# Altium project main_board.PrjPCB
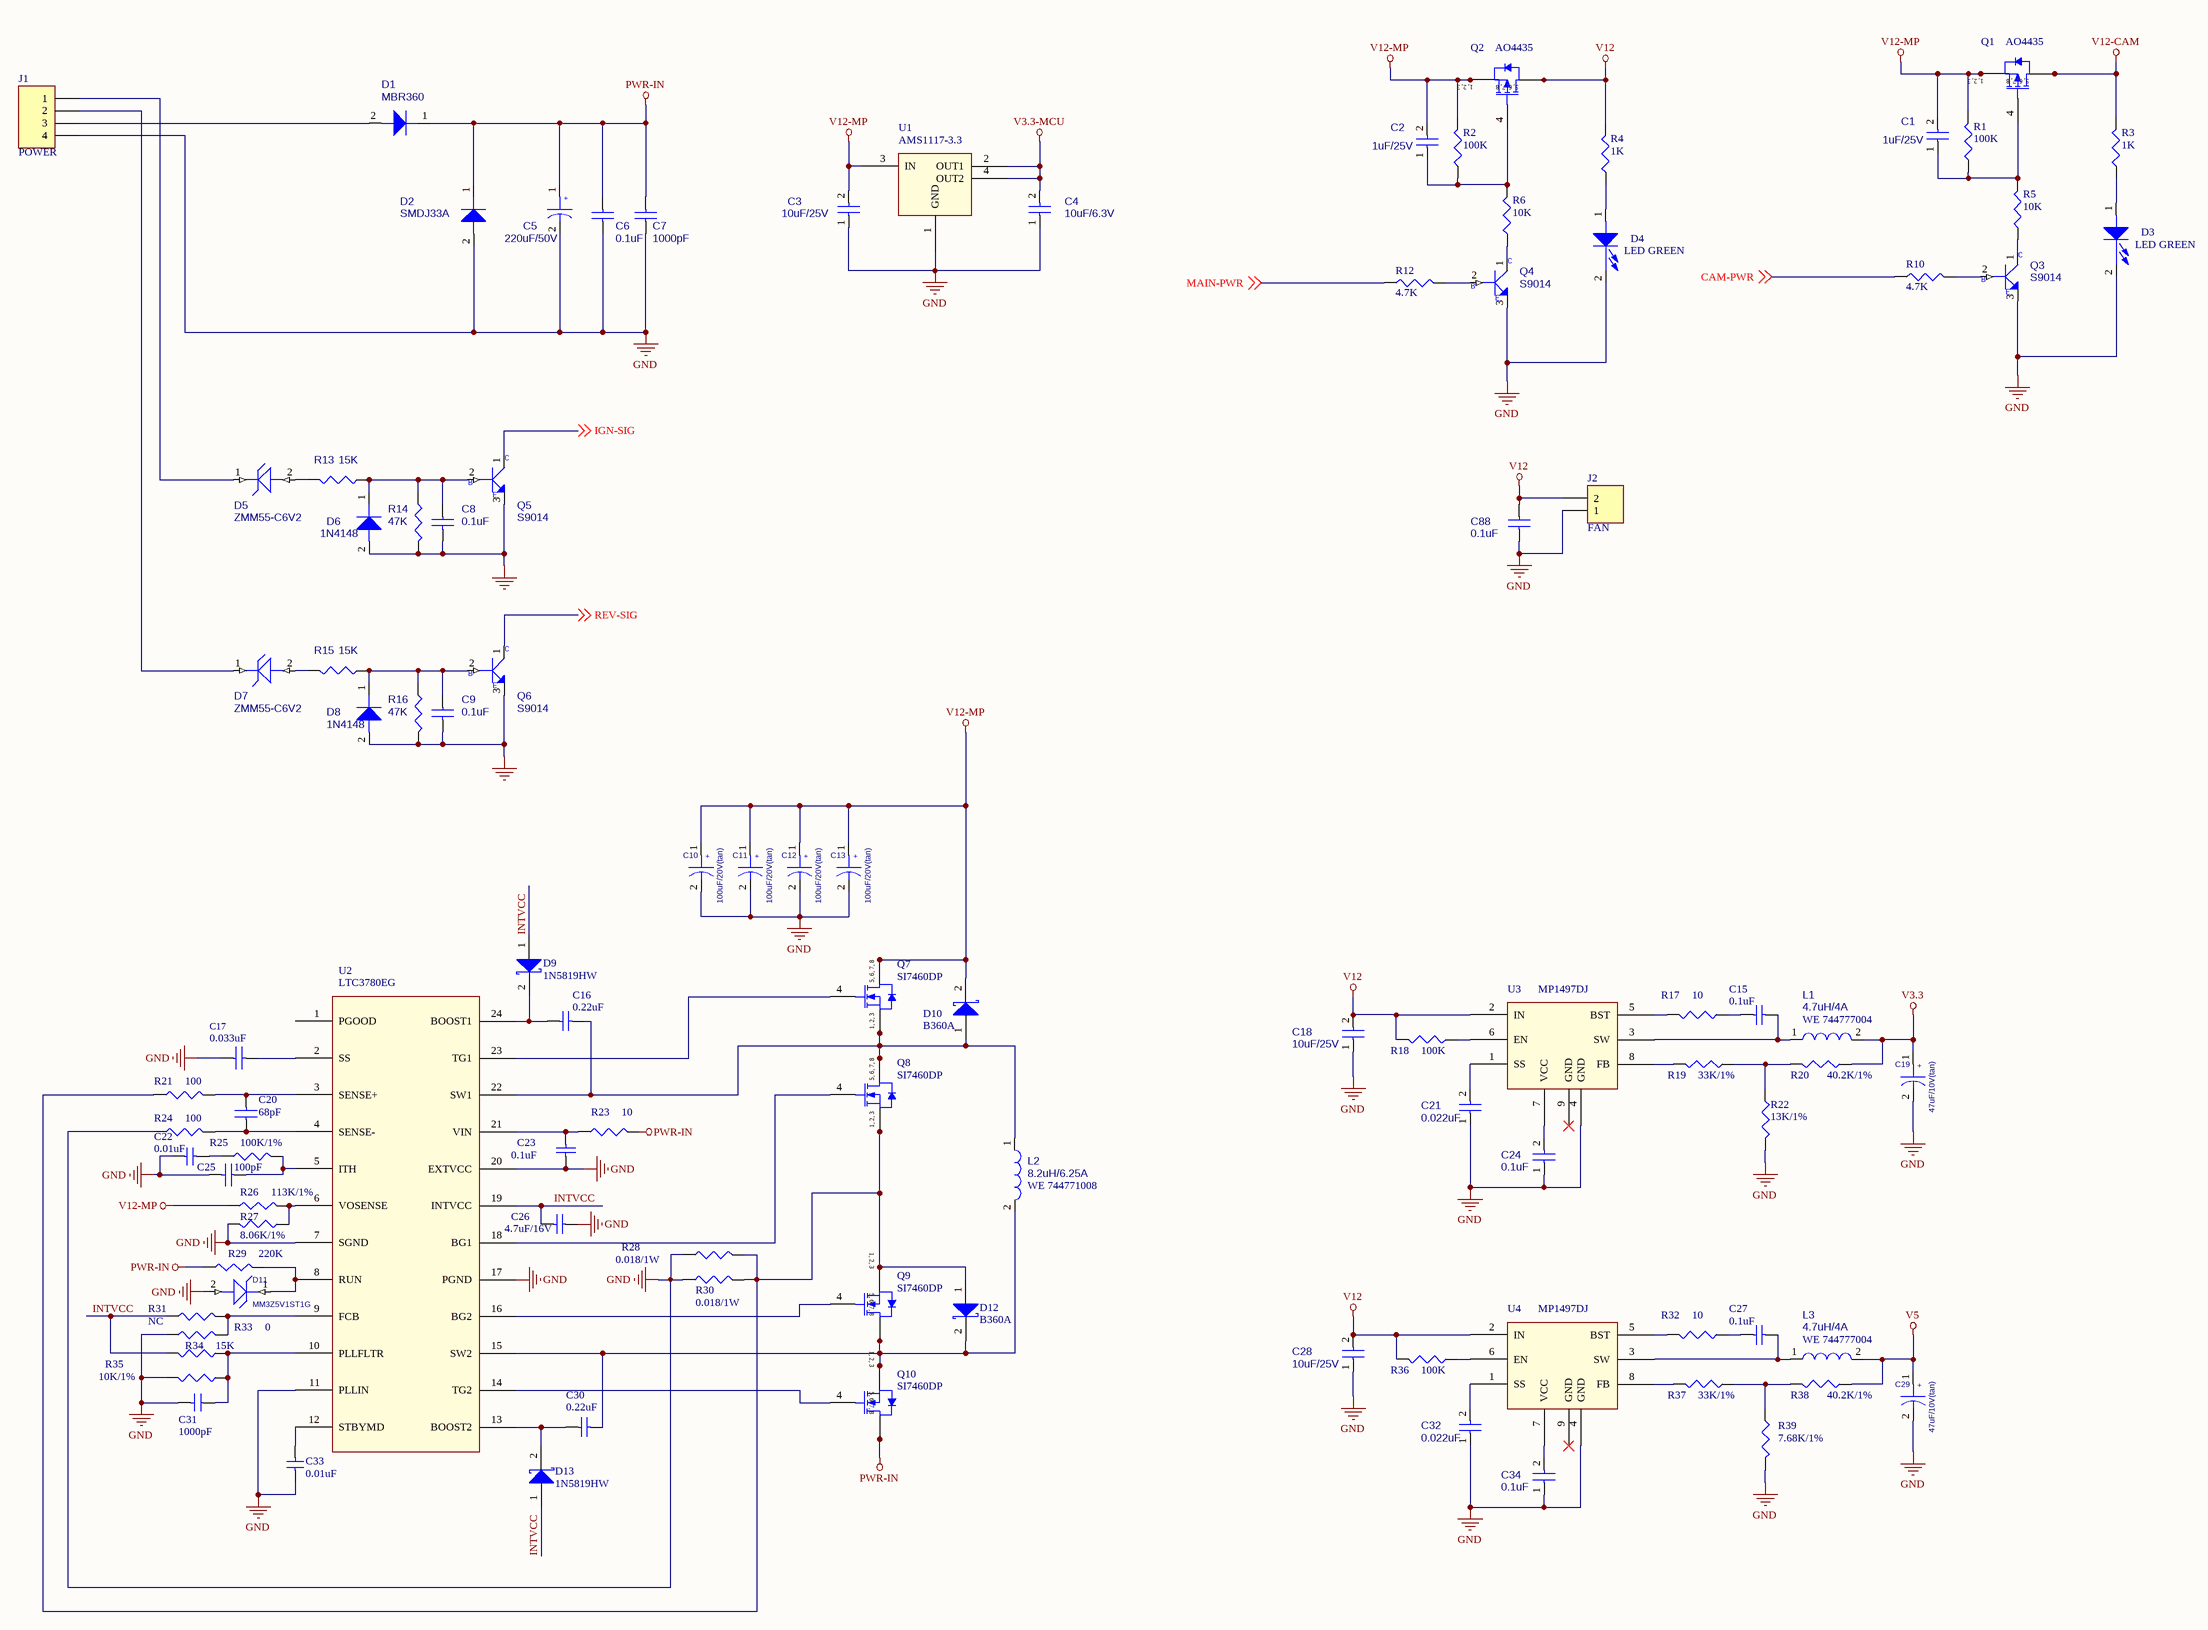
[diagram p0: [01]POWER.SchDoc]
12 sheets, 319 parts. Net scope: global (net labels, ports and power ports of the same name join across sheets).
Board file: main_board.PcbDoc
Sheets:
  [01]POWER.SchDoc
  [02]MCU.SchDoc
  [03]CORE_BOARD.SchDoc
  [04]STORAGE.SchDoc
  [05]USB_HUB.SchDoc
  [06]EXT_UART.SchDoc
  [07]CELLULAR.SchDoc
  [08]GPS.SchDoc
  [09]ADC.SchDoc
  [10]MISC.SchDoc
  [11]SERIAL_PORT.SchDoc
  [12]IO_PORT.SchDoc

## Sheet [01]POWER.SchDoc
size C

### Parts
C1  1uF/25V  [0805]
C2  1uF/25V  [0805]
C3  10uF/25V  [1812]
C4  10uF/6.3V  [0805]
C5  220uF/50V  [DL-10*10.5]
C6  0.1uF  [0603]
C7  1000pF  [0603]
C8  0.1uF  [0603]
C9  0.1uF  [0603]
C10  100uF/20V(tan)  [7343]
C11  100uF/20V(tan)  [7343]
C12  100uF/20V(tan)  [7343]
C13  100uF/20V(tan)  [7343]
C15  0.1uF  [0603]
C16  0.22uF  [0603]
C17  0.033uF  [0603]
C18  10uF/25V  [1812]
C19  47uF/10V(tan)  [3528]
C20  68pF  [0603]
C21  0.022uF  [0603]
C22  0.01uF  [0603]
C23  0.1uF  [0603]
C24  0.1uF  [0603]
C25  100pF  [0603]
C26  4.7uF/16V  [0805]
C27  0.1uF  [0603]
C28  10uF/25V  [1812]
C29  47uF/10V(tan)  [3528]
C30  0.22uF  [0603]
C31  1000pF  [0603]
C32  0.022uF  [0603]
C33  0.01uF  [0603]
C34  0.1uF  [0603]
C88  0.1uF  [0603]
D1  MBR360  [DO214AB]
D2  SMDJ33A  [DO214AB]
D3  LED GREEN  [LED0603]
D4  LED GREEN  [LED0603]
D5  ZMM55-C6V2  [MINI-MELF]
D6  1N4148  [MINI-MELF]
D7  ZMM55-C6V2  [MINI-MELF]
D8  1N4148  [MINI-MELF]
D9  1N5819HW  [1N5819]
D10  B360A  [B320A]
D11  MM3Z5V1ST1G  [MM3Z5V1ST1G]
D12  B360A  [B320A]
D13  1N5819HW  [1N5819]
J1  POWER  [5557-4PIN]
J2  FAN  [XH2.0-2P-SMD]
L1  4.7uH/4A  code: WE 744777004  [IND-4.7UH-4A]
L2  8.2uH/6.25A  code: WE 744771008  [IND-8.2UH-10A]
L3  4.7uH/4A  code: WE 744777004  [IND-4.7UH-4A]
Q1  AO4435  [SO8]
Q2  AO4435  [SO8]
Q3  S9014  [NPN]
Q4  S9014  [NPN]
Q5  S9014  [NPN]
Q6  S9014  [NPN]
Q7  SI7460DP  [POWERPAK]
Q8  SI7460DP  [POWERPAK]
Q9  SI7460DP  [POWERPAK]
Q10  SI7460DP  [POWERPAK]
R1  100K  [0603]
R2  100K  [0603]
R3  1K  [0603]
R4  1K  [0603]
R5  10K  [0603]
R6  10K  [0603]
R10  4.7K  [0603]
R12  4.7K  [0603]
R13  15K  [0603]
R14  47K  [0603]
R15  15K  [0603]
R16  47K  [0603]
R17  10  [0603]
R18  100K  [0603]
R19  33K/1%  [0603]
R20  40.2K/1%  [0603]
R21  100  [0603]
R22  13K/1%  [0603]
R23  10  [0603]
R24  100  [0603]
R25  100K/1%  [0603]
R26  113K/1%  [0603]
R27  8.06K/1%  [0603]
R28  0.018/1W  [2512]
R29  220K  [0603]
R30  0.018/1W  [2512]
R31  NC  [0603]
R32  10  [0603]
R33  0  [0603]
R34  15K  [0603]
R35  10K/1%  [0603]
R36  100K  [0603]
R37  33K/1%  [0603]
R38  40.2K/1%  [0603]
R39  7.68K/1%  [0603]
U1  AMS1117-3.3  [AMS1117]
U2  LTC3780EG  [LTC3780EG]
U3  MP1497DJ  [TSOT23-8]
U4  MP1497DJ  [TSOT23-8]

### Nets
GND: C3.1 C4.1 C5.2 C6.1 C7.1 C8.2 C9.2 C10.2 C11.2 C12.2 C13.2 C17.1 C18.1 C19.2 C21.1 C22.1 C23.1 C24.1 C25.2 C26.2 C28.1 C29.2 C31.2 C32.1 C33.1 C34.1 C88.1 D2.2 D3.2(CATHODE) D4.2(CATHODE) D6.2 D8.2 D11.2 J1.4 J2.1 Q3.3(EMITTER) Q4.3(EMITTER) Q5.3(EMITTER) Q6.3(EMITTER) R14.2 R16.2 R22.2 R24.1 R27.2 R28.1 R30.1 R33.1 R35.2 R39.2 U1.1(GND) U2.7(SGND) U2.11(PLLIN) U2.17(PGND) U2.20(EXTVCC) U3.4(GND) U4.4(GND)
PWR-IN: C5.1 C6.2 C7.2 D1.1 D2.1 Q10.5(D) Q10.6(D) Q10.7(D) Q10.8(D) R23.2 R29.1
V3.3: C19.1 L1.2 R20.1
V3.3-MCU: C4.2 U1.2(OUT1) U1.4(OUT2)
V5: C29.1 L3.2 R38.1
V12: C18.2 C28.2 C88.2 J2.2 Q2.5(D) Q2.6(D) Q2.7(D) Q2.8(D) R4.2 R18.2 R36.2 U3.2(IN) U4.2(IN)
V12-CAM: Q1.5(D) Q1.6(D) Q1.7(D) Q1.8(D) R3.2
V12-MP: C1.2 C2.2 C3.2 C10.1 C11.1 C12.1 C13.1 D10.2(K) Q1.1(S) Q1.2(S) Q1.3(S) Q2.1(S) Q2.2(S) Q2.3(S) Q7.5(D) Q7.6(D) Q7.7(D) Q7.8(D) R1.2 R2.2 R26.1 U1.3(IN)
CAM-PWR: R10.1 ; off-sheet CAM-PWR
IGN-SIG: Q5.1(COLLECTOR) ; off-sheet IGN-SIG
INTVCC: C26.1 D9.1(A) D13.1(A) R31.1 R34.2 U2.19(INTVCC)
MAIN-PWR: R12.1 ; off-sheet MAIN-PWR
REV-SIG: Q6.1(COLLECTOR) ; off-sheet REV-SIG
NetC1_1: C1.1 Q1.4(G) R1.1 R5.2
NetC2_1: C2.1 Q2.4(G) R2.1 R6.2
NetC8_1: C8.1 D6.1 Q5.2(BASE) R13.1 R14.1
NetC9_1: C9.1 D8.1 Q6.2(BASE) R15.1 R16.1
NetC15_1: C15.1 L1.1 U3.3(SW)
NetC15_2: C15.2 R17.1
NetC16_1: C16.1 D10.1(A) L2.1 Q7.1(S) Q7.2(S) Q7.3(S) Q8.5(D) Q8.6(D) Q8.7(D) Q8.8(D) U2.22(SW1)
NetC16_2: C16.2 D9.2(K) U2.24(BOOST1)
NetC17_2: C17.2 U2.2(SS)
NetC20_1: C20.1 R24.2 U2.4(SENSE-)
NetC20_2: C20.2 R21.2 U2.3(SENSE+)
NetC21_2: C21.2 U3.1(SS)
NetC22_2: C22.2 R25.1
NetC23_2: C23.2 R23.1 U2.21(VIN)
NetC24_2: C24.2 U3.7(VCC)
NetC25_1: C25.1 R25.2 U2.5(ITH)
NetC27_1: C27.1 L3.1 U4.3(SW)
NetC27_2: C27.2 R32.1
NetC30_1: C30.1 D12.2(K) L2.2 Q9.5(D) Q9.6(D) Q9.7(D) Q9.8(D) Q10.1(S) Q10.2(S) Q10.3(S) U2.15(SW2)
NetC30_2: C30.2 D13.2(K) U2.13(BOOST2)
NetC31_1: C31.1 R34.1 R35.1 U2.10(PLLFLTR)
NetC32_2: C32.2 U4.1(SS)
NetC33_2: C33.2 U2.12(STBYMD)
NetC34_2: C34.2 U4.7(VCC)
NetD1_2: D1.2 J1.3
NetD3_1: D3.1(ANODE) R3.1
NetD4_1: D4.1(ANODE) R4.1
NetD5_1: D5.1 J1.1
NetD5_2: D5.2 R13.2
NetD7_1: D7.1 J1.2
NetD7_2: D7.2 R15.2
NetD11_1: D11.1 R29.2 U2.8(RUN)
NetD12_1: D12.1(A) Q8.1(S) Q8.2(S) Q8.3(S) Q9.1(S) Q9.2(S) Q9.3(S) R21.1 R28.2 R30.2
NetQ3_1: Q3.1(COLLECTOR) R5.1
NetQ3_2: Q3.2(BASE) R10.2
NetQ4_1: Q4.1(COLLECTOR) R6.1
NetQ4_2: Q4.2(BASE) R12.2
NetQ7_4: Q7.4(G) U2.23(TG1)
NetQ8_4: Q8.4(G) U2.18(BG1)
NetQ9_4: Q9.4(G) U2.16(BG2)
NetQ10_4: Q10.4(G) U2.14(TG2)
NetR17_2: R17.2 U3.5(BST)
NetR18_1: R18.1 U3.6(EN)
NetR19_1: R19.1 R20.2 R22.1
NetR19_2: R19.2 U3.8(FB)
NetR26_2: R26.2 R27.1 U2.6(VOSENSE)
NetR31_2: R31.2 R33.2 U2.9(FCB)
NetR32_2: R32.2 U4.5(BST)
NetR36_1: R36.1 U4.6(EN)
NetR37_1: R37.1 R38.2 R39.1
NetR37_2: R37.2 U4.8(FB)

Not connected (* = marked no-connect by the designer): U2 1(PGOOD); U3 9(GND)*; U4 9(GND)*

### Notes on the sheet
- (in symbol CAP WP) +
- (in symbol MMBT3904_NL_SOT23-3) C; B; E
- (in symbol SI4410DY) 1, 2, 3; 5, 6, 7, 8
- (in symbol SI4431DY) 1, 2, 3; 5, 6, 7, 8

### Library data of the parts
C1-C4 C6 C7 C18 C21 C24 C28 C32 C34 C88 = CAP NP_Dup2
C5 C10-C13 C19 C29 = CAP WP
C8 C9 = CAP
C15 C16 C23 C26 C27 C30 = Cap: Capacitor
C17 C20 = 06033C223KAT1A_0
C22 = 06033C103KAT2A
C25 = 06035A470KAT1A_0
C31 C33 = 06033C103KAT2A_0
D1 D2 D6 D8 = 1N4148WS-7-F_SOD323-2
D3 D4 = LN01401_1
D5 D7 D11 = MMGZ5231BPTLL34
D9 D10 D12 D13 = Diode 11DQ03: Schottky Rectifier
J1 = Header 4: Header, 4-Pin
J2 = Header 2: Header, 2-Pin; LatestRevisionDate: 17-Jul-2002; LatestRevisionNote: Re-released for DXP Platform.; Publisher: Altium Limited
L1-L3 = 4.7UH_CDH2D09BNP-4R7MC_0.7A_20%
Q1 Q2 = SI4431DY: P-Channel 30V (D-S)  MOSFET; Published: 8-Jun-2000; LatestRevisionDate: 13-Apr-2006; LatestRevisionNote: IPC-7351 Footprint Added.; DatasheetVersion: 6-Oct-1997; PackageVersion: Aug-1998; PackageReference: SO-8; Publisher: Altium Limited; PackageDescription: 8-Pin Small Outline Integrated Circuit 1.27 mm Pitch; ComponentLink1Description: Manufacturer Link; ComponentLink1URL: http://www.vishay.com/; ComponentLink2Description: Datasheet; ComponentLink2URL: http://www.vishay.com/docs/70151/70151.pdf
Q3-Q5 = MMBT3904_NL_SOT23-3: Part Description: S TR MMBT3904_NL NPN SOT23; Part Number: SB039040000
Q6 = MMBT3904_NL_SOT23-3
Q7-Q10 = SI4410DY: N-Channel 30V (D-S)  MOSFET
R1-R6 R10 R12 R17-R20 R22 R23 R25 R28 R30-R39 = CR16-1003FM
R13-R16 = R
R21 R24 = CR16-1241FM
R26 = CR16-1133FM
R27 = CR16-8061FM
R29 = CR16-224JM
U1 = LT1963EST-1_4.8
U3 U4 = MP1482_5

## Sheet [02]MCU.SchDoc
size B
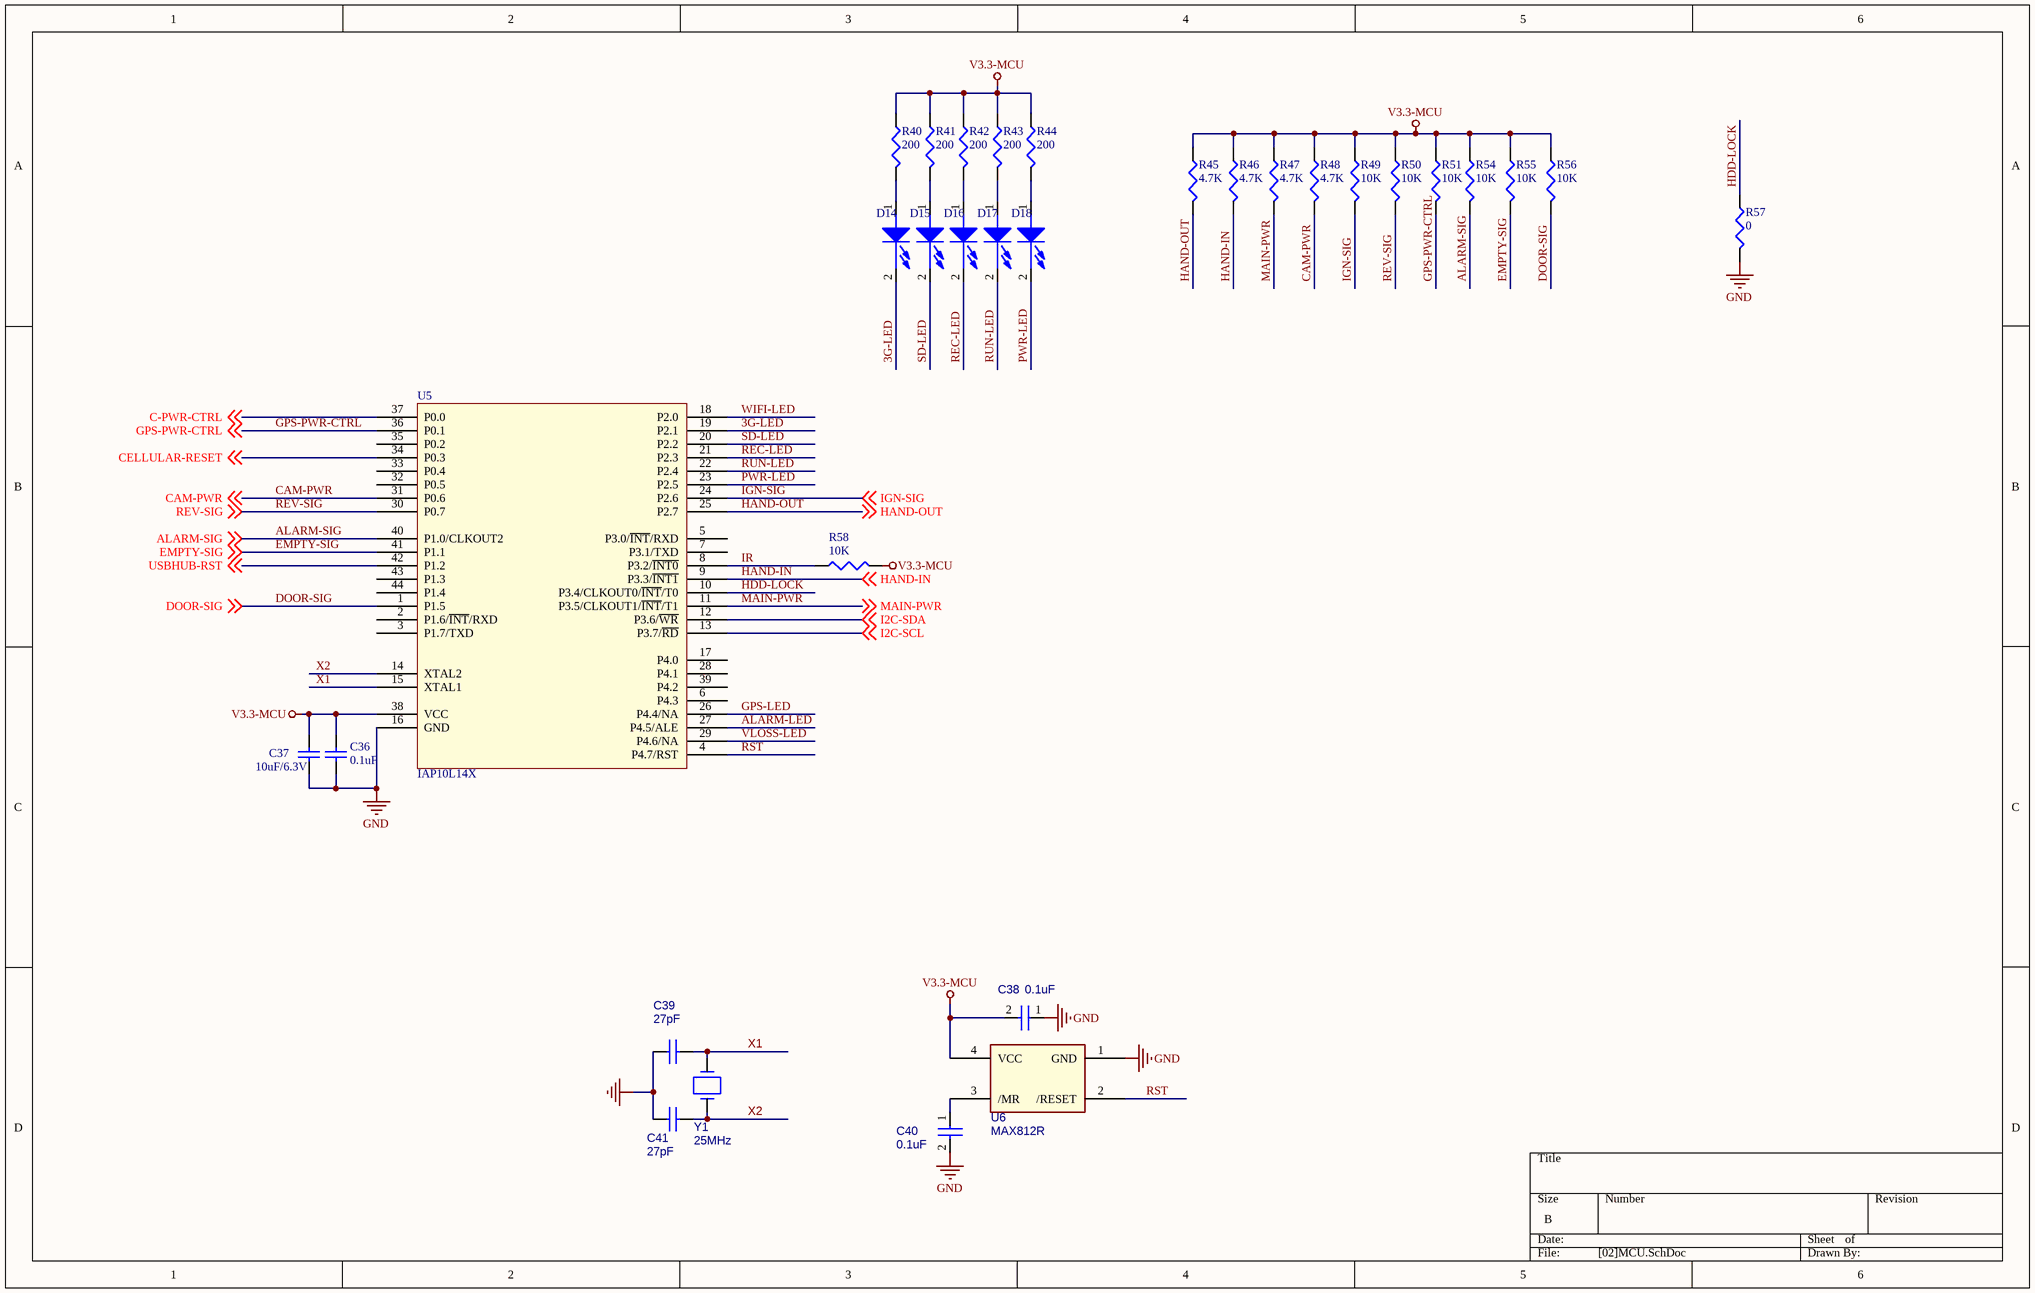
[diagram p1: [02]MCU.SchDoc]

### Parts
C36  0.1uF  [0603]
C37  10uF/6.3V  [0805]
C38  0.1uF  [0603]
C39  27pF  [0603]
C40  0.1uF  [0603]
C41  27pF  [0603]
D14  LED GREEN  [LED0603]  (value not drawn)
D15  LED GREEN  [LED0603]  (value not drawn)
D16  LED GREEN  [LED0603]  (value not drawn)
D17  LED GREEN  [LED0603]  (value not drawn)
D18  LED GREEN  [LED0603]  (value not drawn)
R40  200  [0603]
R41  200  [0603]
R42  200  [0603]
R43  200  [0603]
R44  200  [0603]
R45  4.7K  [0603]
R46  4.7K  [0603]
R47  4.7K  [0603]
R48  4.7K  [0603]
R49  10K  [0603]
R50  10K  [0603]
R51  10K  [0603]
R54  10K  [0603]
R55  10K  [0603]
R56  10K  [0603]
R57  0  [0603]
R58  10K  [0603]
U5  IAP10L14X  [LQFP44]
U6  MAX812R  [SOT143]
Y1  25MHz  [SMD-XTAL-5032]

### Nets
GND: C36.1 C37.1 C38.1 C39.1 C40.2 C41.1 R57.2 U5.16(GND) U6.1(GND)
V3.3-MCU: C36.2 C37.2 C38.2 R40.1 R41.1 R42.1 R43.1 R44.1 R45.1 R46.1 R47.1 R48.1 R49.1 R50.1 R51.1 R54.1 R55.1 R56.1 R58.2 U5.38(VCC) U6.4(VCC)
3G-LED: D14.2(CATHODE) U5.19(P2.1)
ALARM-LED: U5.27(P4.5/ALE)
ALARM-SIG: R54.2 U5.40(P1.0/CLKOUT2) ; off-sheet ALARM-SIG
C-PWR-CTRL: U5.37(P0.0) ; off-sheet C-PWR-CTRL
CAM-PWR: R48.2 U5.31(P0.6) ; off-sheet CAM-PWR
CELLULAR-RESET: U5.34(P0.3) ; off-sheet CELLULAR-RESET
DOOR-SIG: R56.2 U5.1(P1.5) ; off-sheet DOOR-SIG
EMPTY-SIG: R55.2 U5.41(P1.1) ; off-sheet EMPTY-SIG
GPS-LED: U5.26(P4.4/NA)
GPS-PWR-CTRL: R51.2 U5.36(P0.1) ; off-sheet GPS-PWR-CTRL
HAND-IN: R46.2 U5.9(P3.3/~{INT1}) ; off-sheet HAND-IN
HAND-OUT: R45.2 U5.25(P2.7) ; off-sheet HAND-OUT
HDD-LOCK: R57.1 U5.10(P3.4/CLKOUT0/~{INT}/T0)
I2C-SCL: U5.13(P3.7/~{RD}) ; off-sheet I2C-SCL
I2C-SDA: U5.12(P3.6/~{WR}) ; off-sheet I2C-SDA
IGN-SIG: R49.2 U5.24(P2.6) ; off-sheet IGN-SIG
IR: R58.1 U5.8(P3.2/~{INT0})
MAIN-PWR: R47.2 U5.11(P3.5/CLKOUT1/~{INT}/T1) ; off-sheet MAIN-PWR
PWR-LED: D18.2(CATHODE) U5.23(P2.5)
REC-LED: D16.2(CATHODE) U5.21(P2.3)
REV-SIG: R50.2 U5.30(P0.7) ; off-sheet REV-SIG
RST: U5.4(P4.7/RST) U6.2(/RESET)
RUN-LED: D17.2(CATHODE) U5.22(P2.4)
SD-LED: D15.2(CATHODE) U5.20(P2.2)
USBHUB-RST: U5.42(P1.2) ; off-sheet USBHUB-RST
VLOSS-LED: U5.29(P4.6/NA)
WIFI-LED: U5.18(P2.0)
X1: C39.2 U5.15(XTAL1) Y1.2
X2: C41.2 U5.14(XTAL2) Y1.1
NetC40_1: C40.1 U6.3(/MR)
NetD14_1: D14.1(ANODE) R40.2
NetD15_1: D15.1(ANODE) R41.2
NetD16_1: D16.1(ANODE) R42.2
NetD17_1: D17.1(ANODE) R43.2
NetD18_1: D18.1(ANODE) R44.2

Not connected (* = marked no-connect by the designer): U5 2(P1.6/~{INT}/RXD) 3(P1.7/TXD) 5(P3.0/~{INT}/RXD) 6(P4.3) 7(P3.1/TXD) 17(P4.0) 28(P4.1) 32(P0.5) 33(P0.4) 35(P0.2) 39(P4.2) 43(P1.3) 44(P1.4)

### Library data of the parts
C36 C37 = Cap: Capacitor
C38 C40 = CAP NP_Dup2
C39 C41 = CAP_Dup1
D14-D18 = LN01401_1
R40-R51 R54-R58 = CR16-1003FM
U6 = MAX811
Y1 = CRYSTAL

## Sheet [03]CORE_BOARD.SchDoc
size B
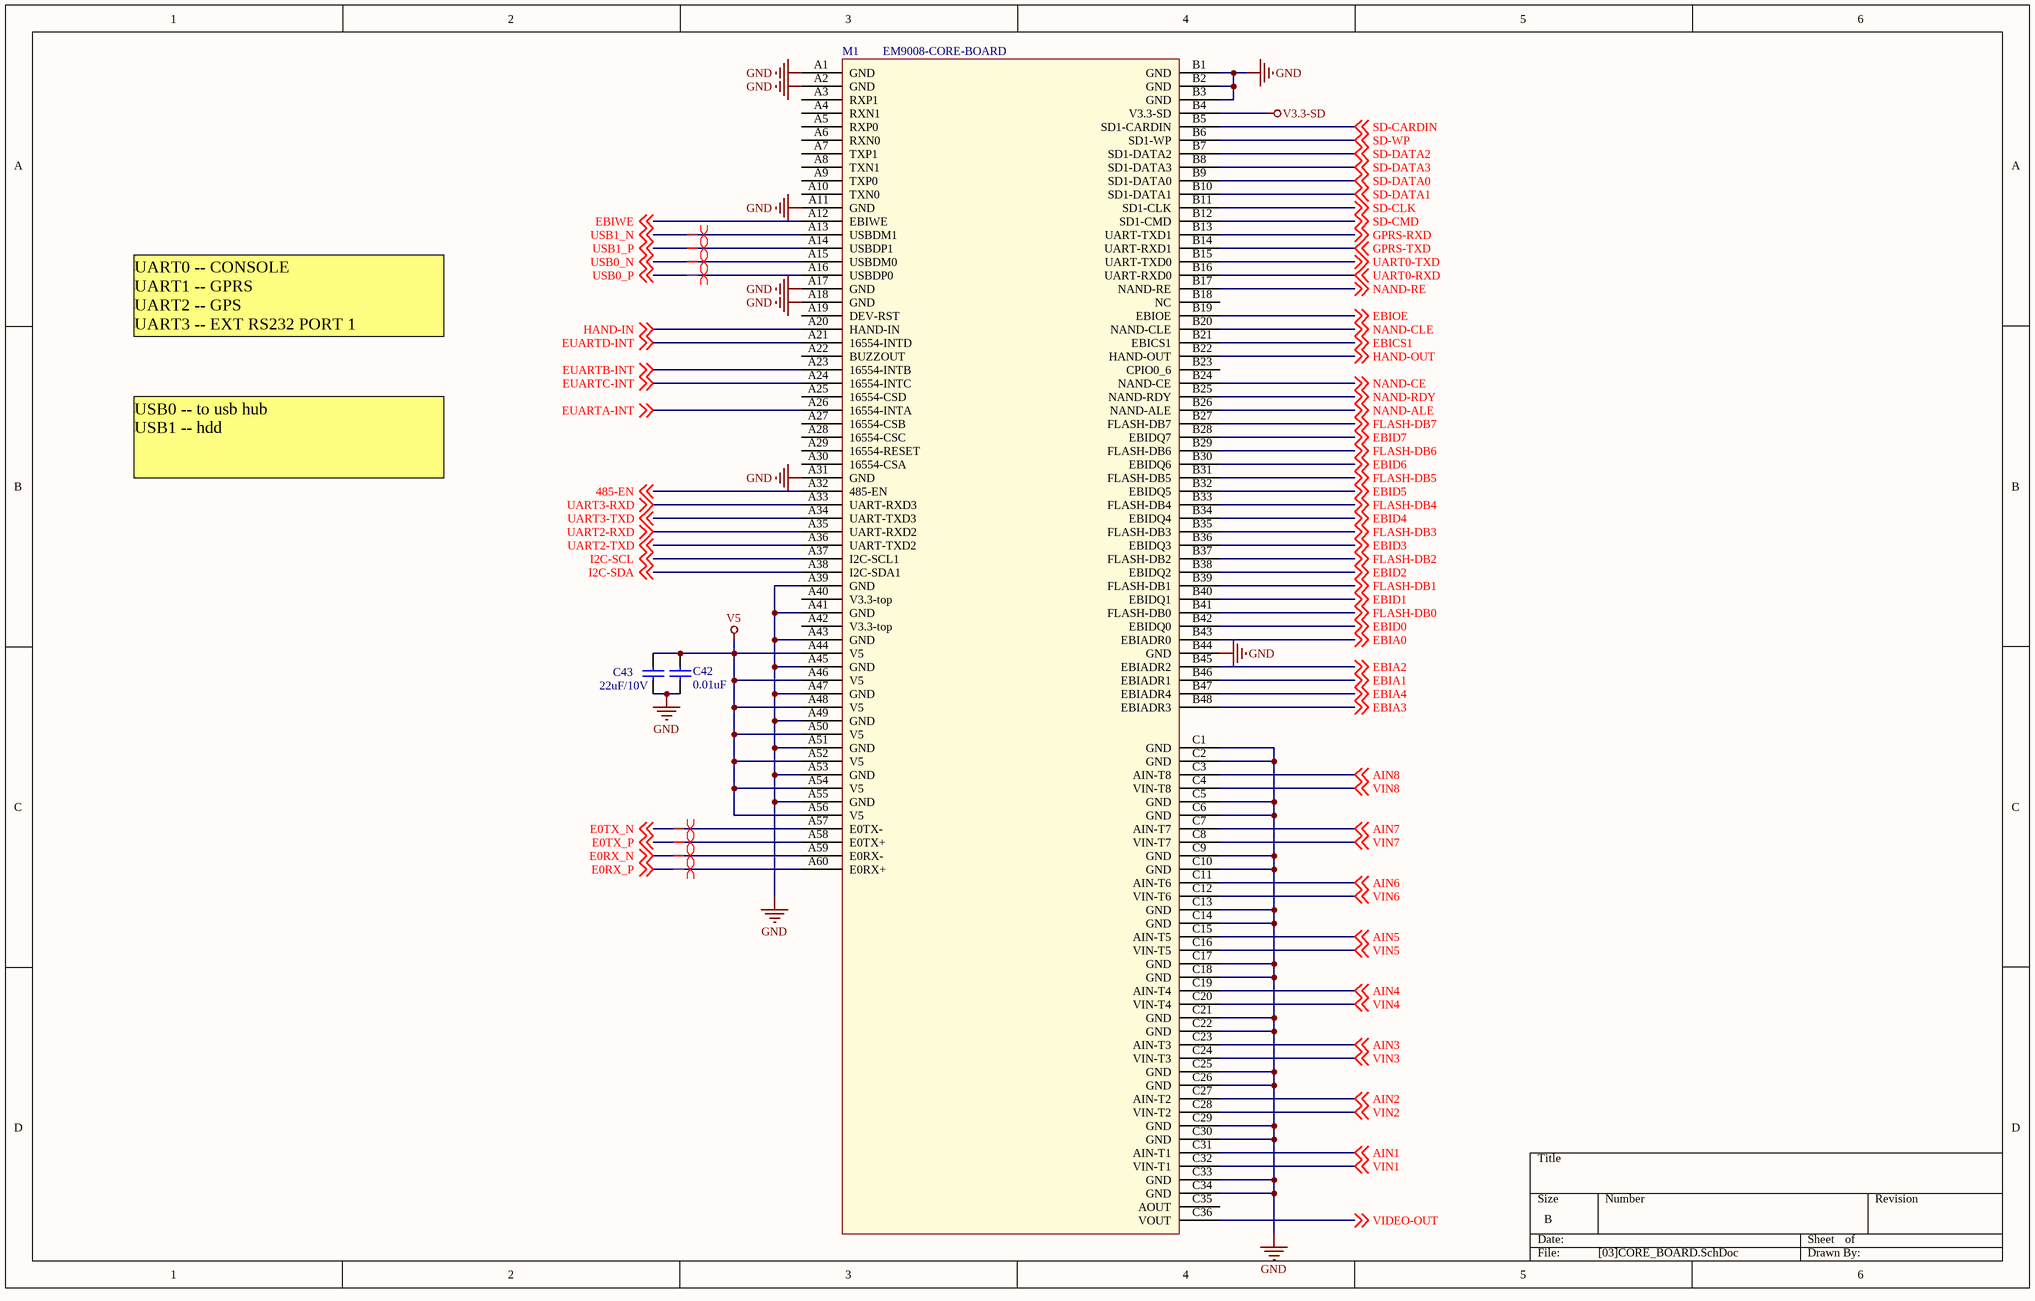
[diagram p2: [03]CORE_BOARD.SchDoc]

### Parts
C42  0.01uF  [0603]
C43  22uF/10V  [1210]
M1  EM9008-CORE-BOARD  [EM9008]

### Nets
GND: C42.1 C43.1 M1.A1(GND) M1.A2(GND) M1.A11(GND) M1.A17(GND) M1.A18(GND) M1.A31(GND) M1.A39(GND) M1.A41(GND) M1.A43(GND) M1.A45(GND) M1.A47(GND) M1.A49(GND) M1.A51(GND) M1.A53(GND) M1.A55(GND) M1.B1(GND) M1.B2(GND) M1.B3(GND) M1.B44(GND) M1.C1(GND) M1.C2(GND) M1.C5(GND) M1.C6(GND) M1.C9(GND) M1.C10(GND) M1.C13(GND) M1.C14(GND) M1.C17(GND) M1.C18(GND) M1.C21(GND) M1.C22(GND) M1.C25(GND) M1.C26(GND) M1.C29(GND) M1.C30(GND) M1.C33(GND) M1.C34(GND)
V3.3-SD: M1.B4(V3.3-SD)
V5: C42.2 C43.2 M1.A44(V5) M1.A46(V5) M1.A48(V5) M1.A50(V5) M1.A52(V5) M1.A54(V5) M1.A56(V5)
485-EN: M1.A32(485-EN) ; off-sheet 485-EN
AIN1: M1.C31(AIN-T1) ; off-sheet AIN1
AIN2: M1.C27(AIN-T2) ; off-sheet AIN2
AIN3: M1.C23(AIN-T3) ; off-sheet AIN3
AIN4: M1.C19(AIN-T4) ; off-sheet AIN4
AIN5: M1.C15(AIN-T5) ; off-sheet AIN5
AIN6: M1.C11(AIN-T6) ; off-sheet AIN6
AIN7: M1.C7(AIN-T7) ; off-sheet AIN7
AIN8: M1.C3(AIN-T8) ; off-sheet AIN8
E0RX_N: M1.A59(E0RX-) ; off-sheet E0RX_N
E0RX_P: M1.A60(E0RX+) ; off-sheet E0RX_P
E0TX_N: M1.A57(E0TX-) ; off-sheet E0TX_N
E0TX_P: M1.A58(E0TX+) ; off-sheet E0TX_P
EBIA0: M1.B43(EBIADR0) ; off-sheet EBIA0
EBIA1: M1.B46(EBIADR1) ; off-sheet EBIA1
EBIA2: M1.B45(EBIADR2) ; off-sheet EBIA2
EBIA3: M1.B48(EBIADR3) ; off-sheet EBIA3
EBIA4: M1.B47(EBIADR4) ; off-sheet EBIA4
EBICS1: M1.B21(EBICS1) ; off-sheet EBICS1
EBID0: M1.B42(EBIDQ0) ; off-sheet EBID0
EBID1: M1.B40(EBIDQ1) ; off-sheet EBID1
EBID2: M1.B38(EBIDQ2) ; off-sheet EBID2
EBID3: M1.B36(EBIDQ3) ; off-sheet EBID3
EBID4: M1.B34(EBIDQ4) ; off-sheet EBID4
EBID5: M1.B32(EBIDQ5) ; off-sheet EBID5
EBID6: M1.B30(EBIDQ6) ; off-sheet EBID6
EBID7: M1.B28(EBIDQ7) ; off-sheet EBID7
EBIOE: M1.B19(EBIOE) ; off-sheet EBIOE
EBIWE: M1.A12(EBIWE) ; off-sheet EBIWE
EUARTA-INT: M1.A26(16554-INTA) ; off-sheet EUARTA-INT
EUARTB-INT: M1.A23(16554-INTB) ; off-sheet EUARTB-INT
EUARTC-INT: M1.A24(16554-INTC) ; off-sheet EUARTC-INT
EUARTD-INT: M1.A21(16554-INTD) ; off-sheet EUARTD-INT
FLASH-DB0: M1.B41(FLASH-DB0) ; off-sheet FLASH-DB0
FLASH-DB1: M1.B39(FLASH-DB1) ; off-sheet FLASH-DB1
FLASH-DB2: M1.B37(FLASH-DB2) ; off-sheet FLASH-DB2
FLASH-DB3: M1.B35(FLASH-DB3) ; off-sheet FLASH-DB3
FLASH-DB4: M1.B33(FLASH-DB4) ; off-sheet FLASH-DB4
FLASH-DB5: M1.B31(FLASH-DB5) ; off-sheet FLASH-DB5
FLASH-DB6: M1.B29(FLASH-DB6) ; off-sheet FLASH-DB6
FLASH-DB7: M1.B27(FLASH-DB7) ; off-sheet FLASH-DB7
GPRS-RXD: M1.B13(UART-TXD1) ; off-sheet GPRS-RXD
GPRS-TXD: M1.B14(UART-RXD1) ; off-sheet GPRS-TXD
HAND-IN: M1.A20(HAND-IN) ; off-sheet HAND-IN
HAND-OUT: M1.B22(HAND-OUT) ; off-sheet HAND-OUT
I2C-SCL: M1.A37(I2C-SCL1) ; off-sheet I2C-SCL
I2C-SDA: M1.A38(I2C-SDA1) ; off-sheet I2C-SDA
NAND-ALE: M1.B26(NAND-ALE) ; off-sheet NAND-ALE
NAND-CE: M1.B24(NAND-CE) ; off-sheet NAND-CE
NAND-CLE: M1.B20(NAND-CLE) ; off-sheet NAND-CLE
NAND-RDY: M1.B25(NAND-RDY) ; off-sheet NAND-RDY
NAND-RE: M1.B17(NAND-RE) ; off-sheet NAND-RE
SD-CARDIN: M1.B5(SD1-CARDIN) ; off-sheet SD-CARDIN
SD-CLK: M1.B11(SD1-CLK) ; off-sheet SD-CLK
SD-CMD: M1.B12(SD1-CMD) ; off-sheet SD-CMD
SD-DATA0: M1.B9(SD1-DATA0) ; off-sheet SD-DATA0
SD-DATA1: M1.B10(SD1-DATA1) ; off-sheet SD-DATA1
SD-DATA2: M1.B7(SD1-DATA2) ; off-sheet SD-DATA2
SD-DATA3: M1.B8(SD1-DATA3) ; off-sheet SD-DATA3
SD-WP: M1.B6(SD1-WP) ; off-sheet SD-WP
UART0-RXD: M1.B16(UART-RXD0) ; off-sheet UART0-RXD
UART0-TXD: M1.B15(UART-TXD0) ; off-sheet UART0-TXD
UART2-RXD: M1.A35(UART-RXD2) ; off-sheet UART2-RXD
UART2-TXD: M1.A36(UART-TXD2) ; off-sheet UART2-TXD
UART3-RXD: M1.A33(UART-RXD3) ; off-sheet UART3-RXD
UART3-TXD: M1.A34(UART-TXD3) ; off-sheet UART3-TXD
USB0_N: M1.A15(USBDM0) ; off-sheet USB0_N
USB0_P: M1.A16(USBDP0) ; off-sheet USB0_P
USB1_N: M1.A13(USBDM1) ; off-sheet USB1_N
USB1_P: M1.A14(USBDP1) ; off-sheet USB1_P
VIDEO-OUT: M1.C36(VOUT) ; off-sheet VIDEO-OUT
VIN1: M1.C32(VIN-T1) ; off-sheet VIN1
VIN2: M1.C28(VIN-T2) ; off-sheet VIN2
VIN3: M1.C24(VIN-T3) ; off-sheet VIN3
VIN4: M1.C20(VIN-T4) ; off-sheet VIN4
VIN5: M1.C16(VIN-T5) ; off-sheet VIN5
VIN6: M1.C12(VIN-T6) ; off-sheet VIN6
VIN7: M1.C8(VIN-T7) ; off-sheet VIN7
VIN8: M1.C4(VIN-T8) ; off-sheet VIN8

Not connected (* = marked no-connect by the designer): M1 A3(RXP1) A4(RXN1) A5(RXP0) A6(RXN0) A7(TXP1) A8(TXN1) A9(TXP0) A10(TXN0) A19(DEV-RST) A22(BUZZOUT) A25(16554-CSD) A27(16554-CSB) A28(16554-CSC) A29(16554-RESET) A30(16554-CSA) A40(V3.3-top) A42(V3.3-top) B18(NC) B23(CPIO0_6) C35(AOUT)

### Layout directives
differential pair: E0RX_N, E0RX_P, E0TX_N, E0TX_P, USB0_N, USB0_P, USB1_N, USB1_P

### Notes on the sheet
- UART0 -- CONSOLE
  UART1 -- GPRS
  UART2 -- GPS
  UART3 -- EXT RS232 PORT 1
- USB0 -- to usb hub
  USB1 -- hdd

### Library data of the parts
C42 C43 = Cap: Capacitor

## Sheet [04]STORAGE.SchDoc
size B
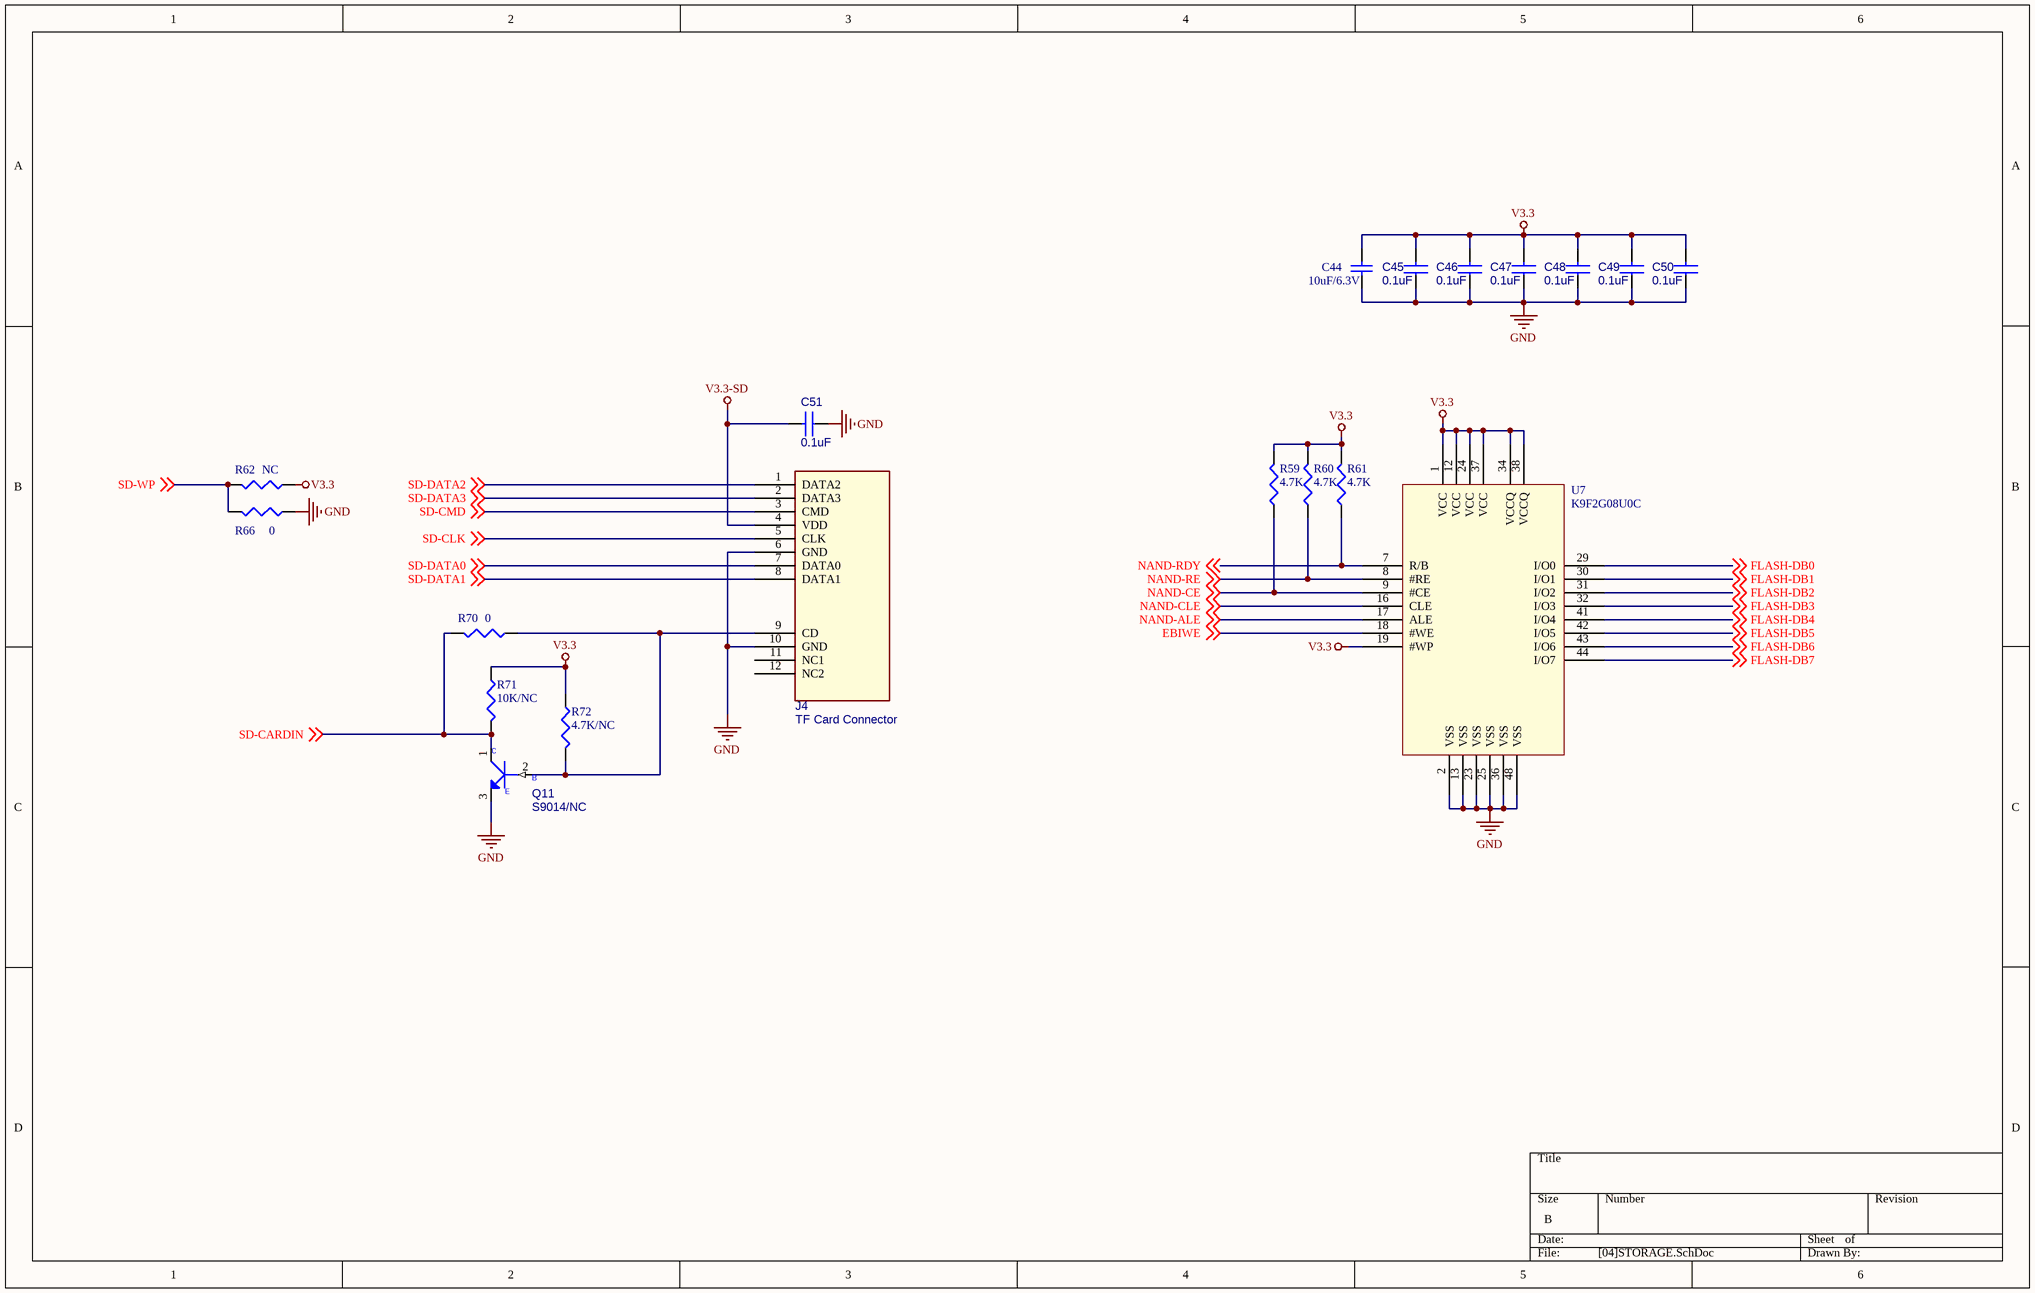
[diagram p3: [04]STORAGE.SchDoc]

### Parts
C44  10uF/6.3V  [0805]
C45  0.1uF  [0603]
C46  0.1uF  [0603]
C47  0.1uF  [0603]
C48  0.1uF  [0603]
C49  0.1uF  [0603]
C50  0.1uF  [0603]
C51  0.1uF  [0603]
J4  TF Card Connector  [TFCARD-2]
Q11  S9014/NC  [NPN]
R59  4.7K  [0603]
R60  4.7K  [0603]
R61  4.7K  [0603]
R62  NC  [0603]
R66  0  [0603]
R70  0  [0603]
R71  10K/NC  [0603]
R72  4.7K/NC  [0603]
U7  K9F2G08U0C  [TSOP48]

### Nets
GND: C44.1 C45.1 C46.1 C47.1 C48.1 C49.1 C50.1 C51.1 J4.6(GND) J4.10(GND) Q11.3(EMITTER) R66.1 U7.2(VSS) U7.13(VSS) U7.23(VSS) U7.25(VSS) U7.36(VSS) U7.48(VSS)
V3.3: C44.2 C45.2 C46.2 C47.2 C48.2 C49.2 C50.2 R59.2 R60.2 R61.2 R62.1 R71.1 R72.1 U7.1(VCC) U7.12(VCC) U7.19(#WP) U7.24(VCC) U7.34(VCCQ) U7.37(VCC) U7.38(VCCQ)
V3.3-SD: C51.2 J4.4(VDD)
EBIWE: U7.18(#WE) ; off-sheet EBIWE
FLASH-DB0: U7.29(I/O0) ; off-sheet FLASH-DB0
FLASH-DB1: U7.30(I/O1) ; off-sheet FLASH-DB1
FLASH-DB2: U7.31(I/O2) ; off-sheet FLASH-DB2
FLASH-DB3: U7.32(I/O3) ; off-sheet FLASH-DB3
FLASH-DB4: U7.41(I/O4) ; off-sheet FLASH-DB4
FLASH-DB5: U7.42(I/O5) ; off-sheet FLASH-DB5
FLASH-DB6: U7.43(I/O6) ; off-sheet FLASH-DB6
FLASH-DB7: U7.44(I/O7) ; off-sheet FLASH-DB7
NAND-ALE: U7.17(ALE) ; off-sheet NAND-ALE
NAND-CE: R59.1 U7.9(#CE) ; off-sheet NAND-CE
NAND-CLE: U7.16(CLE) ; off-sheet NAND-CLE
NAND-RDY: R61.1 U7.7(R/B) ; off-sheet NAND-RDY
NAND-RE: R60.1 U7.8(#RE) ; off-sheet NAND-RE
SD-CARDIN: Q11.1(COLLECTOR) R70.2 R71.2 ; off-sheet SD-CARDIN
SD-CLK: J4.5(CLK) ; off-sheet SD-CLK
SD-CMD: J4.3(CMD) ; off-sheet SD-CMD
SD-DATA0: J4.7(DATA0) ; off-sheet SD-DATA0
SD-DATA1: J4.8(DATA1) ; off-sheet SD-DATA1
SD-DATA2: J4.1(DATA2) ; off-sheet SD-DATA2
SD-DATA3: J4.2(DATA3) ; off-sheet SD-DATA3
SD-WP: R62.2 R66.2 ; off-sheet SD-WP
NetJ4_9: J4.9(CD) Q11.2(BASE) R70.1 R72.2

Not connected (* = marked no-connect by the designer): J4 11(NC1) 12(NC2)

### Notes on the sheet
- (in symbol MMBT3904_NL_SOT23-3) C; B; E

### Library data of the parts
C44 = Cap: Capacitor
C45-C51 = CAP NP_Dup2
J4 = MOLEX_1: CON;HDR,MA,9P,RA,H2.7,SMT
Q11 = MMBT3904_NL_SOT23-3: as Q3 on sheet [01]POWER
R59-R62 R66 R70-R72 = Res3: Resistor
U7 = K9GBG08U0A

## Sheet [05]USB_HUB.SchDoc
size B
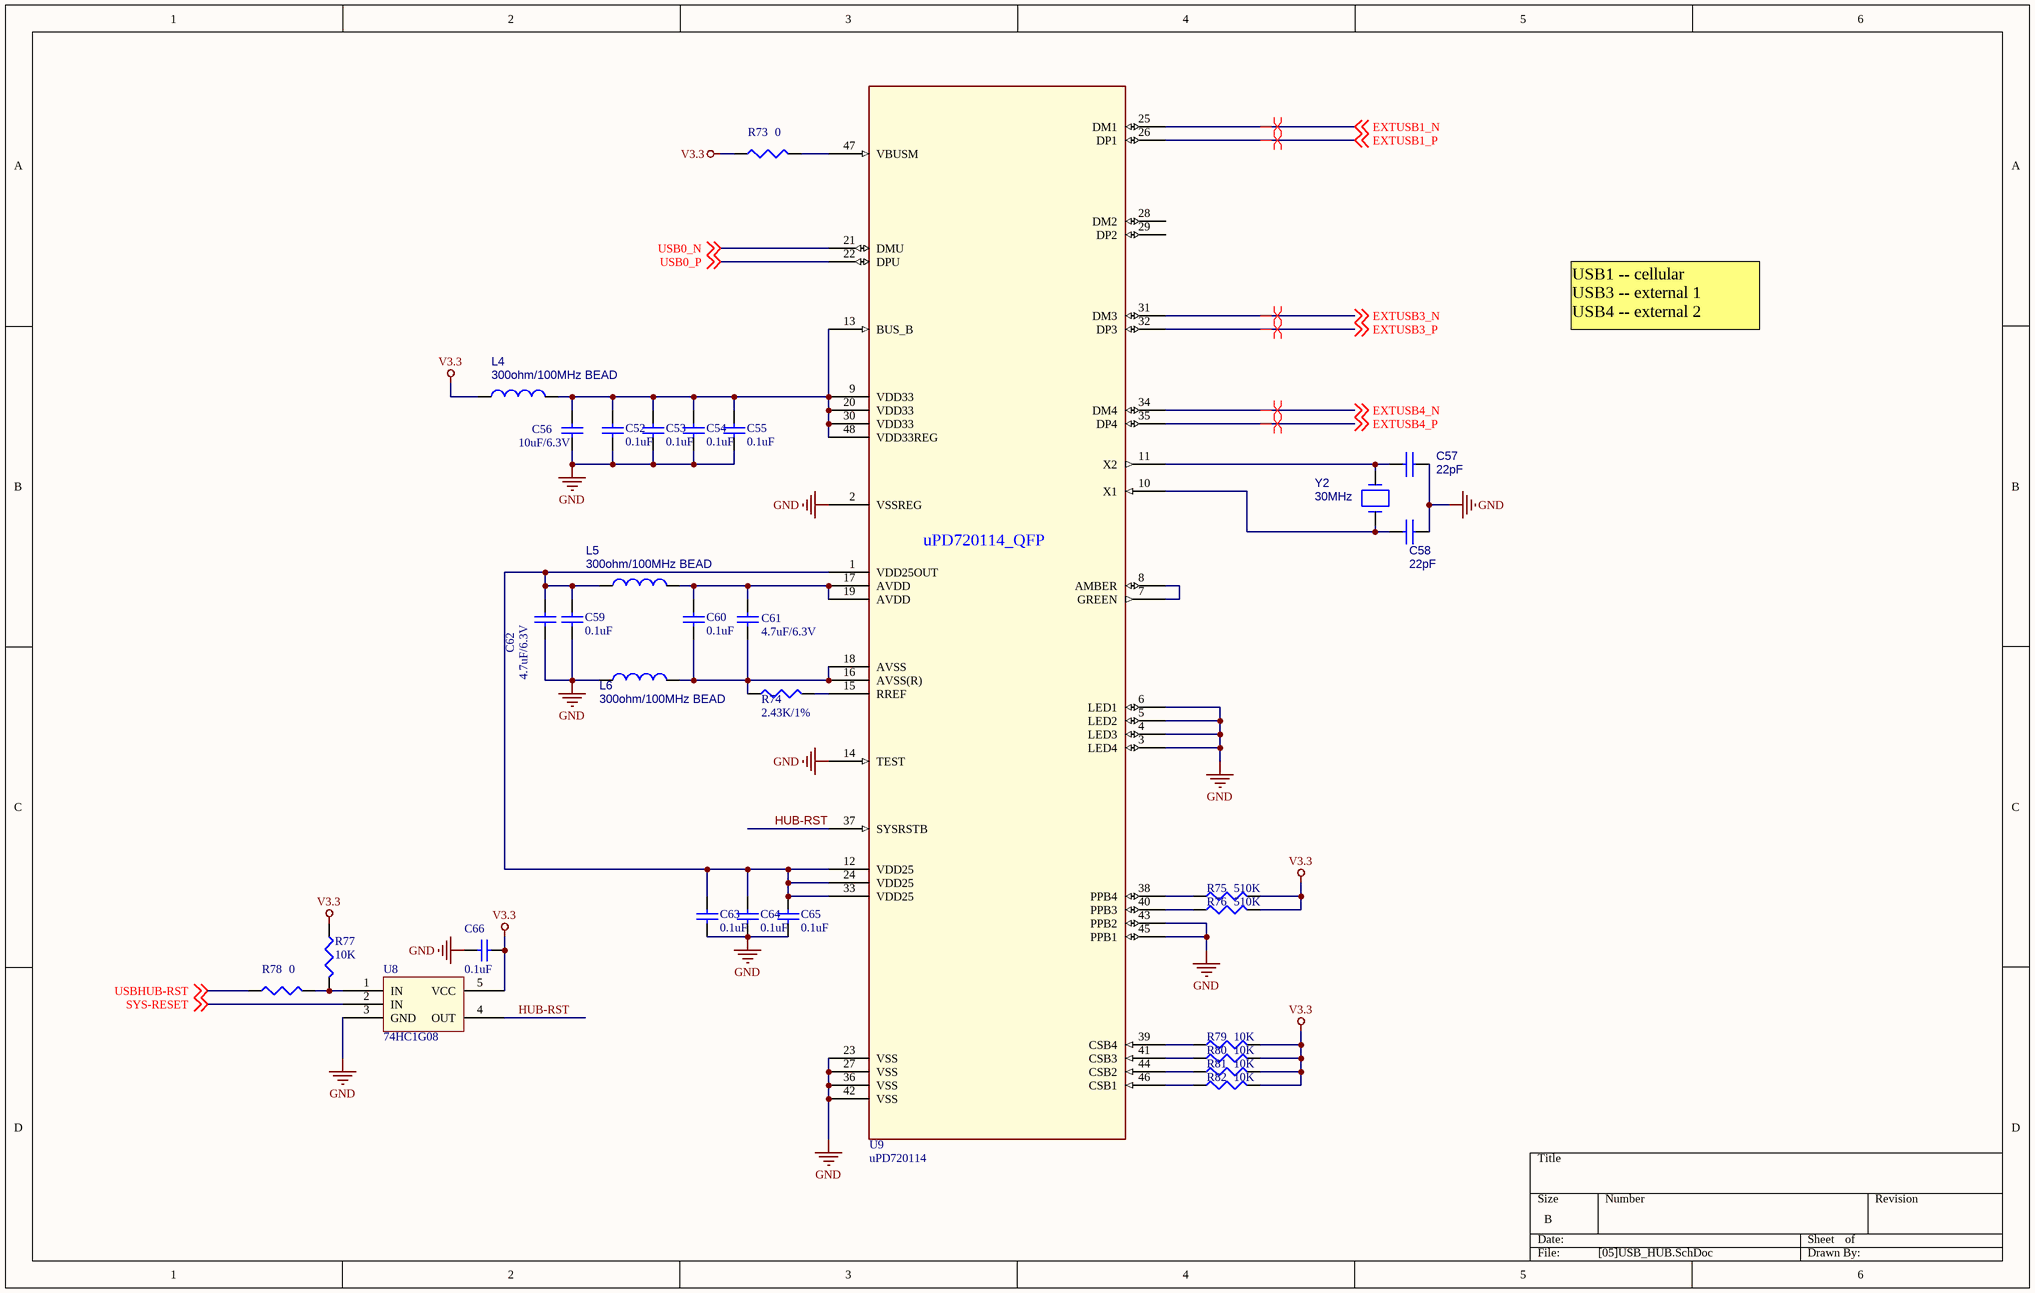
[diagram p4: [05]USB_HUB.SchDoc]

### Parts
C52  0.1uF  [0603]
C53  0.1uF  [0603]
C54  0.1uF  [0603]
C55  0.1uF  [0603]
C56  10uF/6.3V  [0805]
C57  22pF  [0603]
C58  22pF  [0603]
C59  0.1uF  [0603]
C60  0.1uF  [0603]
C61  4.7uF/6.3V  [0603]
C62  4.7uF/6.3V  [0603]
C63  0.1uF  [0603]
C64  0.1uF  [0603]
C65  0.1uF  [0603]
C66  0.1uF  [0603]
L4  300ohm/100MHz BEAD  [0603]
L5  300ohm/100MHz BEAD  [0603]
L6  300ohm/100MHz BEAD  [0603]
R73  0  [0603]
R74  2.43K/1%  [0603]
R75  510K  [0603]
R76  510K  [0603]
R77  10K  [0603]
R78  0  [0603]
R79  10K  [0603]
R80  10K  [0603]
R81  10K  [0603]
R82  10K  [0603]
U8  74HC1G08  [SOT23-5]
U9  uPD720114  [LQFP48]
Y2  30MHz  [SMD-XTAL-5032]

### Nets
GND: C52.1 C53.1 C54.1 C55.1 C56.1 C57.1 C58.1 C59.1 C62.1 C63.1 C64.1 C65.1 C66.2 L6.2 U8.3(GND) U9.2(VSSREG) U9.3(LED4) U9.4(LED3) U9.5(LED2) U9.6(LED1) U9.14(TEST) U9.23(VSS) U9.27(VSS) U9.36(VSS) U9.42(VSS) U9.43(PPB2) U9.45(PPB1)
V3.3: C66.1 L4.2 R73.1 R75.2 R76.2 R77.1 R79.2 R80.2 R81.2 R82.2 U8.5(VCC)
EXTUSB1_N: U9.25(DM1) ; off-sheet EXTUSB1_N
EXTUSB1_P: U9.26(DP1) ; off-sheet EXTUSB1_P
EXTUSB3_N: U9.31(DM3) ; off-sheet EXTUSB3_N
EXTUSB3_P: U9.32(DP3) ; off-sheet EXTUSB3_P
EXTUSB4_N: U9.34(DM4) ; off-sheet EXTUSB4_N
EXTUSB4_P: U9.35(DP4) ; off-sheet EXTUSB4_P
HUB-RST: U8.4(OUT) U9.37(SYSRSTB)
SYS-RESET: U8.2(IN) ; off-sheet SYS-RESET
USB0_N: U9.21(DMU) ; off-sheet USB0_N
USB0_P: U9.22(DPU) ; off-sheet USB0_P
USBHUB-RST: R78.1 ; off-sheet USBHUB-RST
NetC52_2: C52.2 C53.2 C54.2 C55.2 C56.2 L4.1 U9.9(VDD33) U9.13(BUS_B) U9.20(VDD33) U9.30(VDD33) U9.48(VDD33REG)
NetC57_2: C57.2 U9.11(X2) Y2.2
NetC58_2: C58.2 U9.10(X1) Y2.1
NetC59_2: C59.2 C62.2 C63.2 C64.2 C65.2 L5.2 U9.1(VDD25OUT) U9.12(VDD25) U9.24(VDD25) U9.33(VDD25)
NetC60_1: C60.1 C61.1 L6.1 R74.1 U9.16(AVSS(R)) U9.18(AVSS)
NetC60_2: C60.2 C61.2 L5.1 U9.17(AVDD) U9.19(AVDD)
NetR73_2: R73.2 U9.47(VBUSM)
NetR74_2: R74.2 U9.15(RREF)
NetR75_1: R75.1 U9.38(PPB4)
NetR76_1: R76.1 U9.40(PPB3)
NetR77_2: R77.2 R78.2 U8.1(IN)
NetR79_1: R79.1 U9.39(CSB4)
NetR80_1: R80.1 U9.41(CSB3)
NetR81_1: R81.1 U9.44(CSB2)
NetR82_1: R82.1 U9.46(CSB1)
NetU9_7: U9.7(GREEN) U9.8(AMBER)

Not connected (* = marked no-connect by the designer): U9 28(DM2) 29(DP2)

### Layout directives
differential pair: EXTUSB1_N, EXTUSB1_P, EXTUSB3_N, EXTUSB3_P, EXTUSB4_N, EXTUSB4_P

### Notes on the sheet
- USB1 -- cellular
  USB3 -- external 1
  USB4 -- external 2
- (in symbol upd720114_QFP_4) uPD720114_QFP

### Library data of the parts
C52-C56 C59-C66 = Cap: Capacitor
C57 C58 = CAP_Dup1
L4-L6 = INDUCTOR_4
R73-R82 = Res3: Resistor
U9 = upd720114_QFP_4
Y2 = CRYSTAL

## Sheet [06]EXT_UART.SchDoc
size B
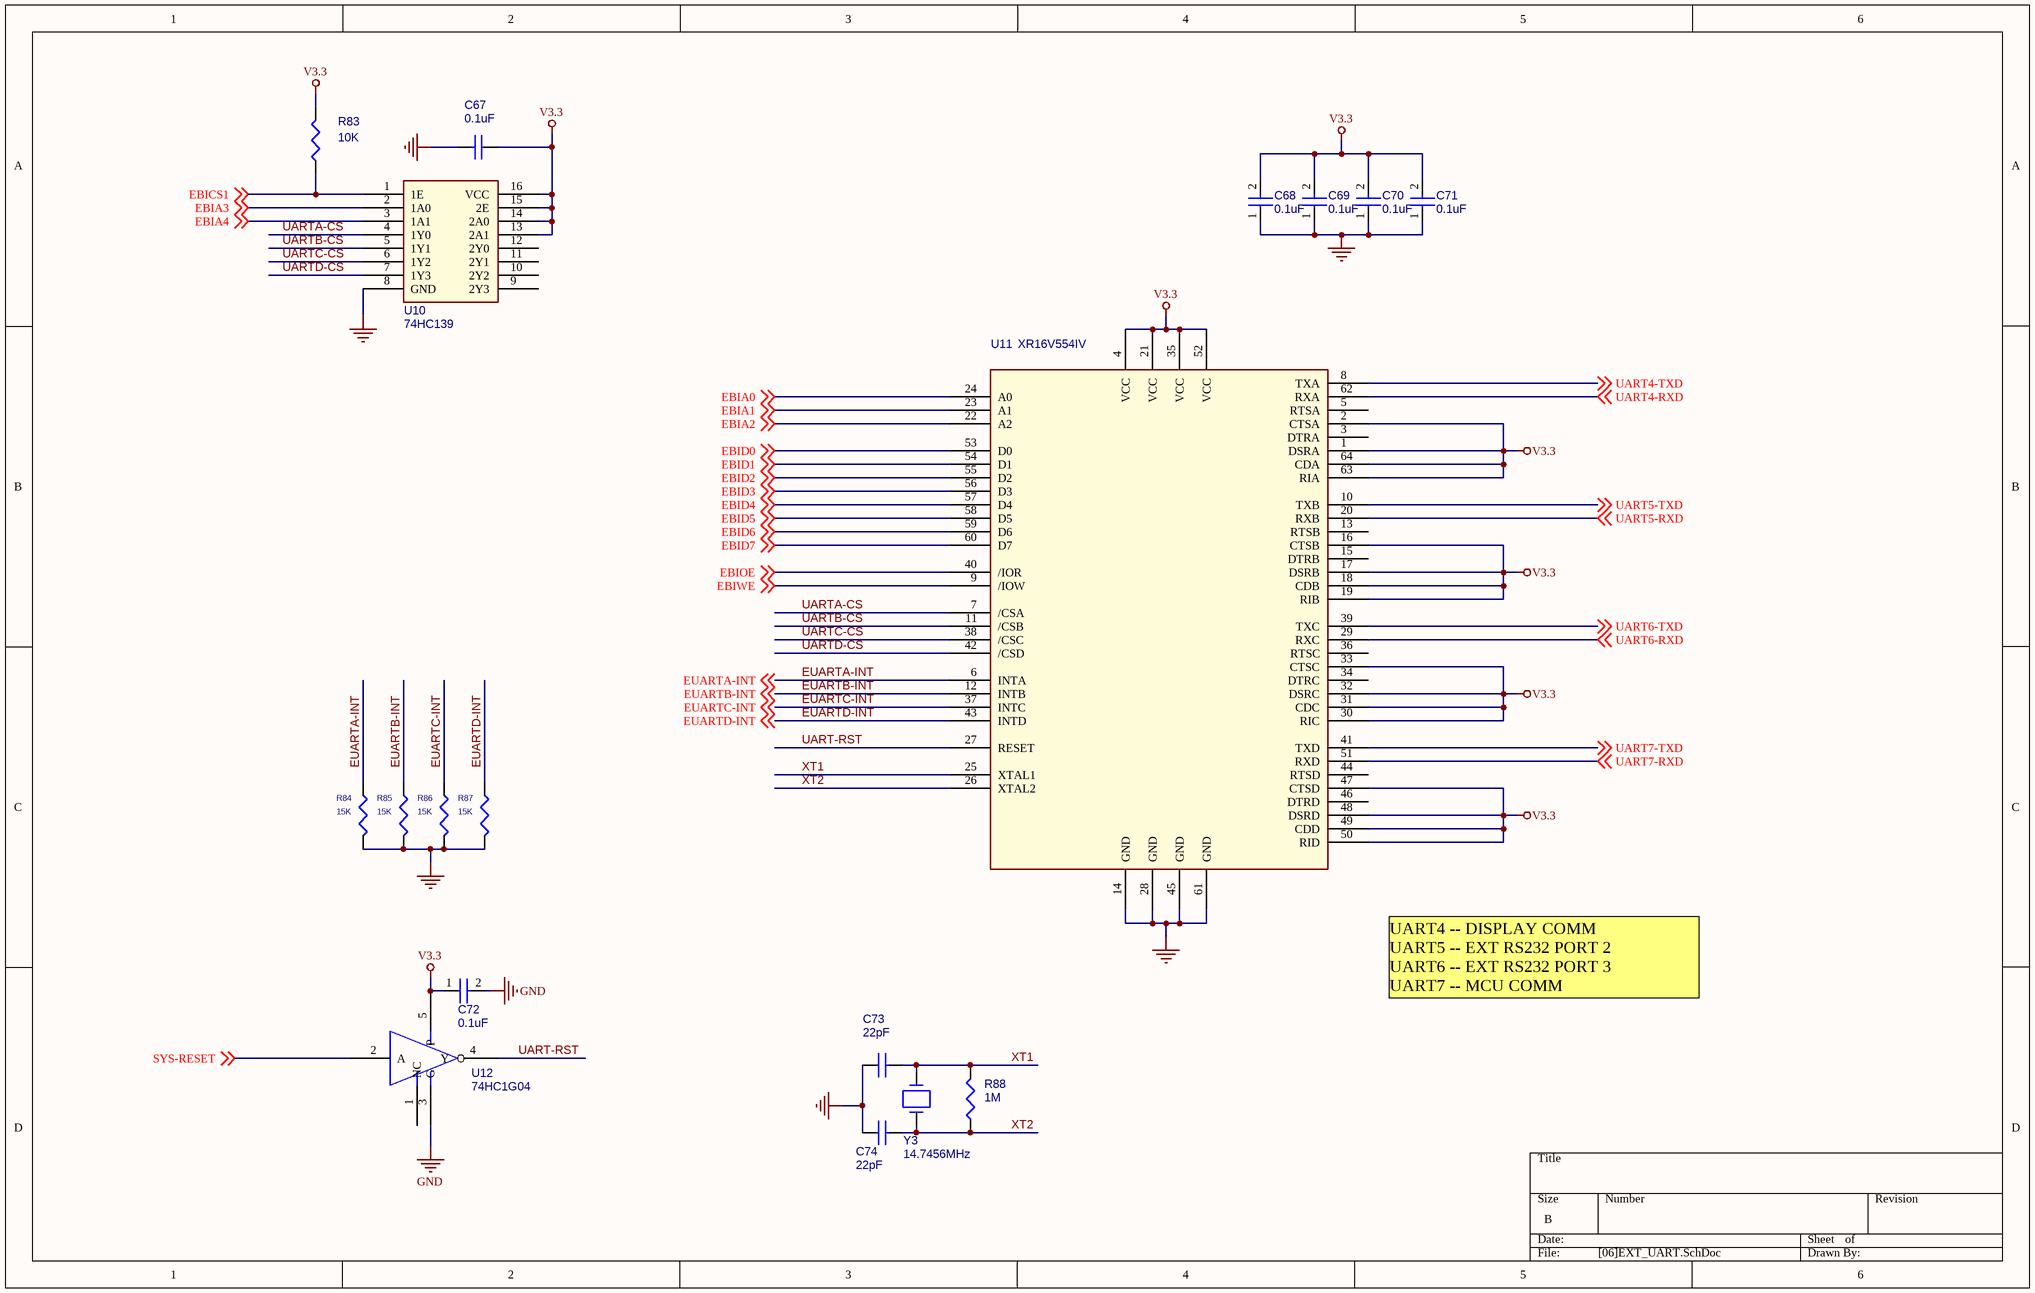
[diagram p5: [06]EXT_UART.SchDoc]

### Parts
C67  0.1uF  [0603]
C68  0.1uF  [0603]
C69  0.1uF  [0603]
C70  0.1uF  [0603]
C71  0.1uF  [0603]
C72  0.1uF  [0603]
C73  22pF  [0603]
C74  22pF  [0603]
R83  10K  [0603]
R84  15K  [0603]
R85  15K  [0603]
R86  15K  [0603]
R87  15K  [0603]
R88  1M  [0603]
U10  74HC139  [SO-16]
U11  XR16V554IV  [LQFP64]
U12  74HC1G04  [SOT753]
Y3  14.7456MHz  [SMD-XTAL-5032]

### Nets
GND: C67.2 C68.1 C69.1 C70.1 C71.1 C72.2 C73.1 C74.1 R84.2 R85.2 R86.2 R87.2 U10.8(GND) U11.14(GND) U11.28(GND) U11.45(GND) U11.61(GND) U12.3(G)
V3.3: C67.1 C68.2 C69.2 C70.2 C71.2 C72.1 R83.2 U10.13(2A1) U10.14(2A0) U10.15(2E) U10.16(VCC) U11.1(DSRA) U11.2(CTSA) U11.4(VCC) U11.16(CTSB) U11.17(DSRB) U11.18(CDB) U11.19(RIB) U11.21(VCC) U11.30(RIC) U11.31(CDC) U11.32(DSRC) U11.33(CTSC) U11.35(VCC) U11.47(CTSD) U11.48(DSRD) U11.49(CDD) U11.50(RID) U11.52(VCC) U11.63(RIA) U11.64(CDA) U12.5(P)
EBIA0: U11.24(A0) ; off-sheet EBIA0
EBIA1: U11.23(A1) ; off-sheet EBIA1
EBIA2: U11.22(A2) ; off-sheet EBIA2
EBIA3: U10.2(1A0) ; off-sheet EBIA3
EBIA4: U10.3(1A1) ; off-sheet EBIA4
EBICS1: R83.1 U10.1(1E) ; off-sheet EBICS1
EBID0: U11.53(D0) ; off-sheet EBID0
EBID1: U11.54(D1) ; off-sheet EBID1
EBID2: U11.55(D2) ; off-sheet EBID2
EBID3: U11.56(D3) ; off-sheet EBID3
EBID4: U11.57(D4) ; off-sheet EBID4
EBID5: U11.58(D5) ; off-sheet EBID5
EBID6: U11.59(D6) ; off-sheet EBID6
EBID7: U11.60(D7) ; off-sheet EBID7
EBIOE: U11.40(/IOR) ; off-sheet EBIOE
EBIWE: U11.9(/IOW) ; off-sheet EBIWE
EUARTA-INT: R84.1 U11.6(INTA) ; off-sheet EUARTA-INT
EUARTB-INT: R85.1 U11.12(INTB) ; off-sheet EUARTB-INT
EUARTC-INT: R86.1 U11.37(INTC) ; off-sheet EUARTC-INT
EUARTD-INT: R87.1 U11.43(INTD) ; off-sheet EUARTD-INT
SYS-RESET: U12.2(A) ; off-sheet SYS-RESET
UART4-RXD: U11.62(RXA) ; off-sheet UART4-RXD
UART4-TXD: U11.8(TXA) ; off-sheet UART4-TXD
UART5-RXD: U11.20(RXB) ; off-sheet UART5-RXD
UART5-TXD: U11.10(TXB) ; off-sheet UART5-TXD
UART6-RXD: U11.29(RXC) ; off-sheet UART6-RXD
UART6-TXD: U11.39(TXC) ; off-sheet UART6-TXD
UART7-RXD: U11.51(RXD) ; off-sheet UART7-RXD
UART7-TXD: U11.41(TXD) ; off-sheet UART7-TXD
UART-RST: U11.27(RESET) U12.4(Y)
UARTA-CS: U10.4(1Y0) U11.7(/CSA)
UARTB-CS: U10.5(1Y1) U11.11(/CSB)
UARTC-CS: U10.6(1Y2) U11.38(/CSC)
UARTD-CS: U10.7(1Y3) U11.42(/CSD)
XT1: C73.2 R88.2 U11.25(XTAL1) Y3.2
XT2: C74.2 R88.1 U11.26(XTAL2) Y3.1

Not connected (* = marked no-connect by the designer): U10 9(2Y3) 10(2Y2) 11(2Y1) 12(2Y0); U11 3(DTRA) 5(RTSA) 13(RTSB) 15(DTRB) 34(DTRC) 36(RTSC) 44(RTSD) 46(DTRD); U12 1(NC)

### Notes on the sheet
- UART4 -- DISPLAY COMM
  UART5 -- EXT RS232 PORT 2
  UART6 -- EXT RS232 PORT 3
  UART7 -- MCU COMM

### Library data of the parts
C67-C72 = CAP NP_Dup2
C73 C74 = CAP_Dup1
R83-R87 = R_Dup1
R88 = RESISTOR
U11 = XR16V554IV_4
U12 = 74LVC1G04GW_SOT353-5: Part  Number: SA00000FX00
Y3 = CRYSTAL

## Sheet [07]CELLULAR.SchDoc
size B
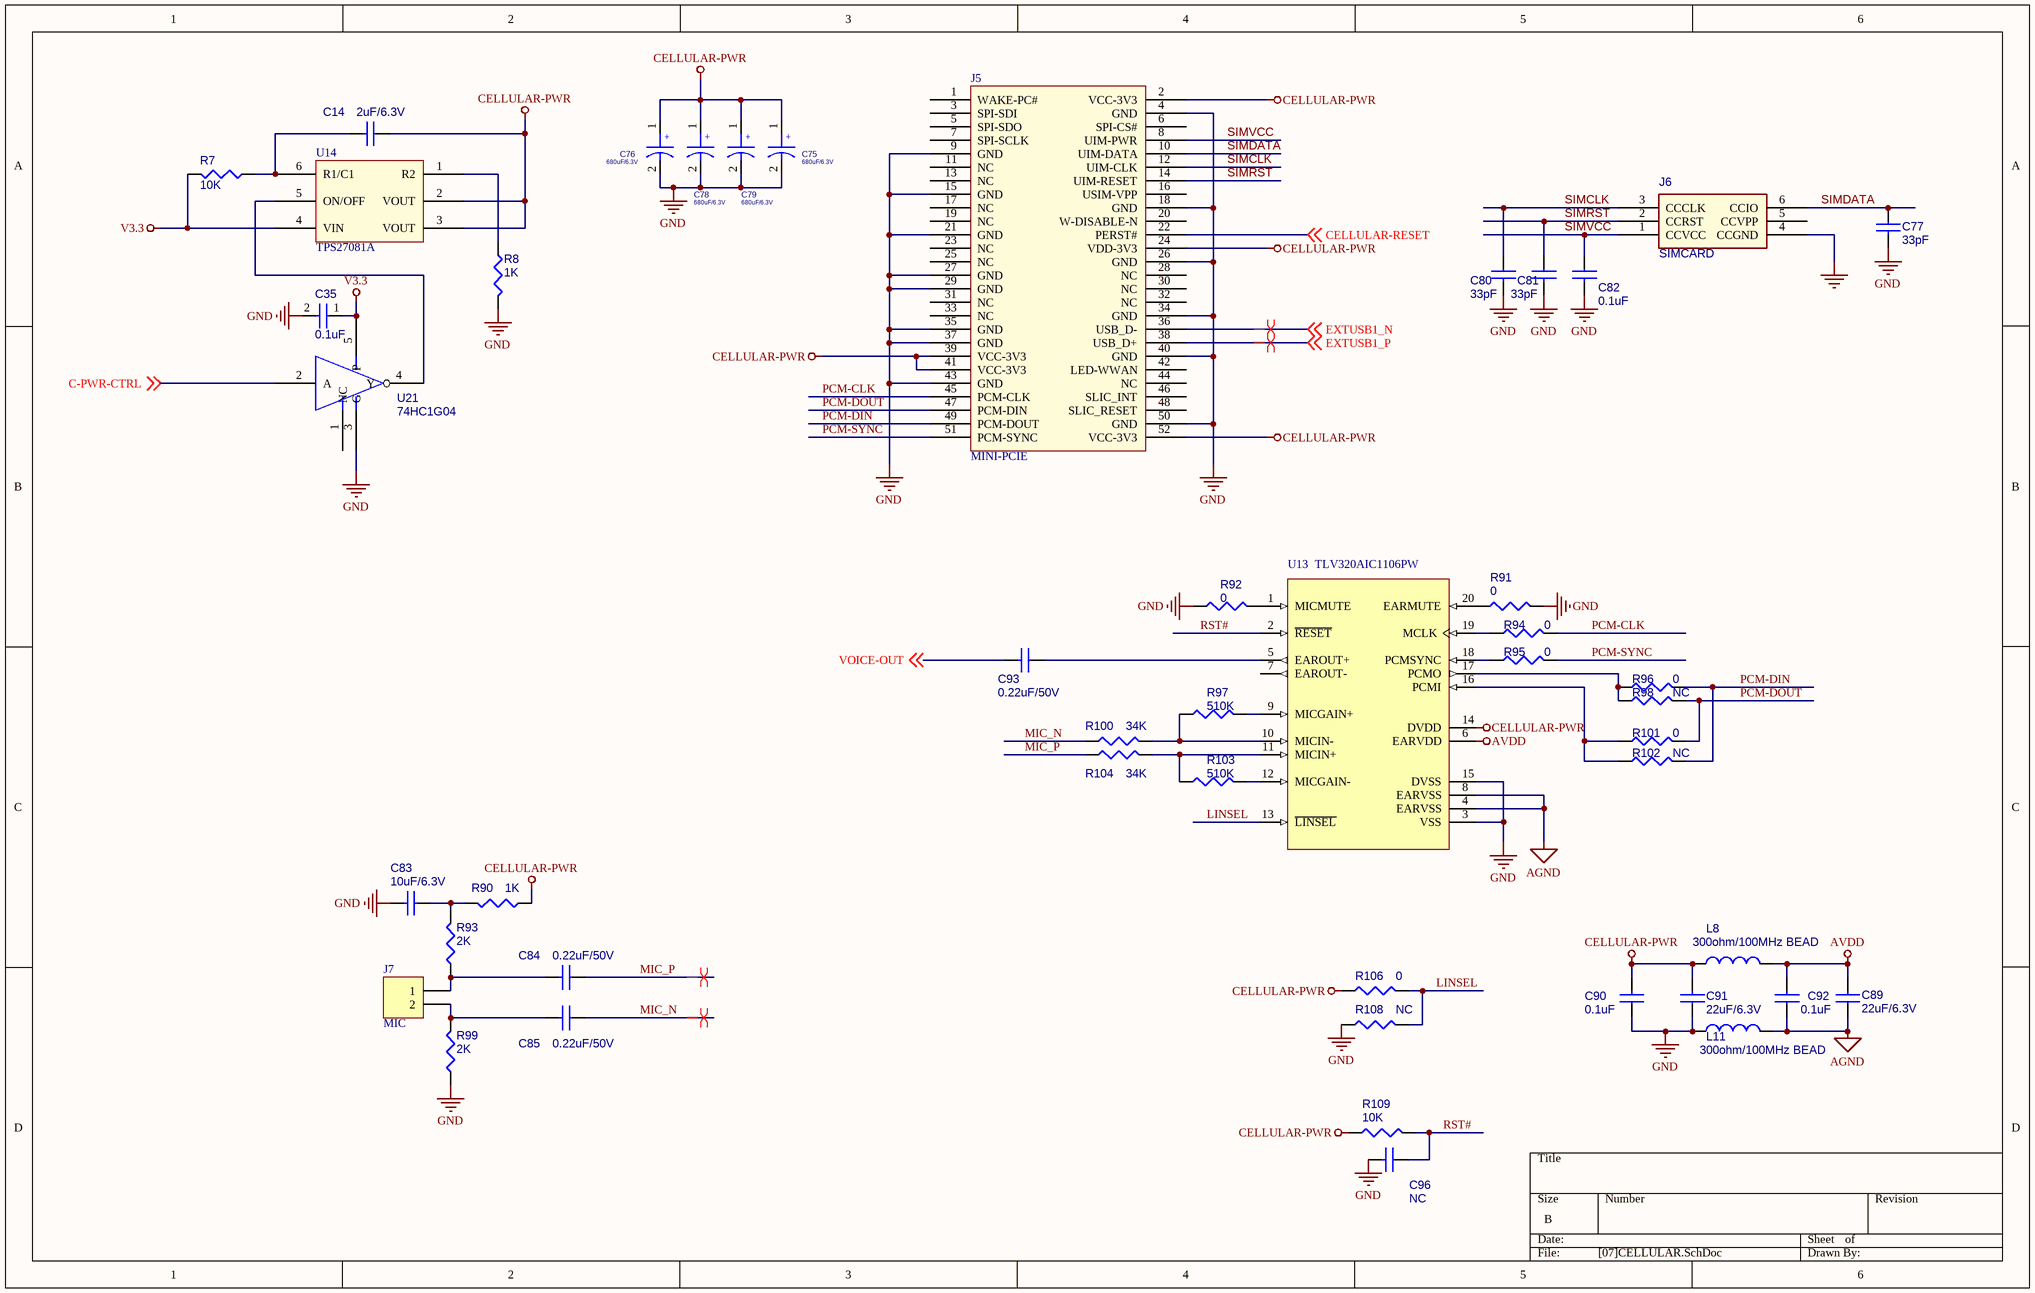
[diagram p6: [07]CELLULAR.SchDoc]

### Parts
C14  2uF/6.3V  [0603]
C35  0.1uF  [0603]
C75  680uF/6.3V  [7343]
C76  680uF/6.3V  [7343]
C77  33pF  [0603]
C78  680uF/6.3V  [7343]
C79  680uF/6.3V  [7343]
C80  33pF  [0603]
C81  33pF  [0603]
C82  0.1uF  [0603]
C83  10uF/6.3V  [0805]
C84  0.22uF/50V  [0603]
C85  0.22uF/50V  [0603]
C89  22uF/6.3V  [0805]
C90  0.1uF  [0603]
C91  22uF/6.3V  [0805]
C92  0.1uF  [0603]
C93  0.22uF/50V  [0603]
C96  NC  [0603]
J5  MINI-PCIE  [MINI-PCIE]
J6  SIMCARD  [SIMLOCK2]
J7  MIC  [CON-2PIN]
L8  300ohm/100MHz BEAD  [0603]
L11  300ohm/100MHz BEAD  [0603]
R7  10K  [0603]
R8  1K  [0603]
R90  1K  [0603]
R91  0  [0603]
R92  0  [0603]
R93  2K  [0603]
R94  0  [0603]
R95  0  [0603]
R96  0  [0603]
R97  510K  [0603]
R98  NC  [0603]
R99  2K  [0603]
R100  34K  [0603]
R101  0  [0603]
R102  NC  [0603]
R103  510K  [0603]
R104  34K  [0603]
R106  0  [0603]
R108  NC  [0603]
R109  10K  [0603]
U13  TLV320AIC1106PW  [PW020]
U14  TPS27081A  [SOT23-6]
U21  74HC1G04  [SOT753]

### Nets
AGND: C89.1 C92.1 L11.1 U13.4(EARVSS) U13.8(EARVSS)
AVDD: C89.2 C92.2 L8.1 U13.6(EARVDD)
CELLULAR-PWR: C14.1 C75.1 C76.1 C78.1 C79.1 C90.2 C91.2 J5.2(VCC-3V3) J5.24(VDD-3V3) J5.39(VCC-3V3) J5.41(VCC-3V3) J5.52(VCC-3V3) L8.2 R90.2 R106.2 R109.2 U13.14(DVDD) U14.2(VOUT) U14.3(VOUT)
GND: C35.2 C75.2 C76.2 C77.2 C78.2 C79.2 C80.2 C81.2 C82.2 C83.2 C90.1 C91.1 C96.2 J5.4(GND) J5.9(GND) J5.15(GND) J5.18(GND) J5.21(GND) J5.26(GND) J5.27(GND) J5.29(GND) J5.34(GND) J5.35(GND) J5.37(GND) J5.40(GND) J5.43(GND) J5.50(GND) J6.4(CCGND) L11.2 R8.1 R91.1 R92.2 R99.2 R108.2 U13.3(VSS) U13.15(DVSS) U21.3(G)
V3.3: C35.1 R7.1 U14.4(VIN) U21.5(P)
C-PWR-CTRL: U21.2(A) ; off-sheet C-PWR-CTRL
CELLULAR-RESET: J5.22(PERST#) ; off-sheet CELLULAR-RESET
EXTUSB1_N: J5.36(USB_D-) ; off-sheet EXTUSB1_N
EXTUSB1_P: J5.38(USB_D+) ; off-sheet EXTUSB1_P
LINSEL: R106.1 R108.1 U13.13(~{LINSEL})
MIC_N: C85.1 R100.2
MIC_P: C84.1 R104.2
PCM-CLK: J5.45(PCM-CLK) R94.1
PCM-DIN: J5.49(PCM-DOUT) R96.1 R102.1
PCM-DOUT: J5.47(PCM-DIN) R98.1 R101.1
PCM-SYNC: J5.51(PCM-SYNC) R95.1
RST#: C96.1 R109.1 U13.2(~{RESET})
SIMCLK: C80.1 J5.12(UIM-CLK) J6.3(CCCLK)
SIMDATA: C77.1 J5.10(UIM-DATA) J6.6(CCIO)
SIMRST: C81.1 J5.14(UIM-RESET) J6.2(CCRST)
SIMVCC: C82.1 J5.8(UIM-PWR) J6.1(CCVCC)
VOICE-OUT: C93.2 ; off-sheet VOICE-OUT
NetC14_2: C14.2 R7.2 U14.6(R1/C1)
NetC83_1: C83.1 R90.1 R93.1
NetC84_2: C84.2 J7.1 R93.2
NetC85_2: C85.2 J7.2 R99.1
NetC93_1: C93.1 U13.5(EAROUT+)
NetR8_2: R8.2 U14.1(R2)
NetR91_2: R91.2 U13.20(EARMUTE)
NetR92_1: R92.1 U13.1(MICMUTE)
NetR94_2: R94.2 U13.19(MCLK)
NetR95_2: R95.2 U13.18(PCMSYNC)
NetR96_2: R96.2 R98.2 U13.17(PCMO)
NetR97_1: R97.1 U13.9(MICGAIN+)
NetR97_2: R97.2 R100.1 U13.10(MICIN-)
NetR101_2: R101.2 R102.2 U13.16(PCMI)
NetR103_1: R103.1 U13.12(MICGAIN-)
NetR103_2: R103.2 R104.1 U13.11(MICIN+)
NetU14_5: U14.5(ON/OFF) U21.4(Y)

Not connected (* = marked no-connect by the designer): J5 1(WAKE-PC#) 3(SPI-SDI) 5(SPI-SDO) 6(SPI-CS#) 7(SPI-SCLK) 11(NC) 13(NC) 16(USIM-VPP) 17(NC) 19(NC) 20(W-DISABLE-N) 23(NC) 25(NC) 28(NC) 30(NC) 31(NC) 32(NC) 33(NC) 42(LED-WWAN) 44(NC) 46(SLIC_INT) 48(SLIC_RESET); J6 5(CCVPP); U13 7(EAROUT-); U21 1(NC)

### Layout directives
differential pair: EXTUSB1_N, EXTUSB1_P, MIC_N, MIC_P

### Notes on the sheet
- (in symbol 10U-6032-20V) +

### Library data of the parts
C14 C77 C80-C85 C89-C93 C96 = P_CAP NP
C35 = CAP NP_Dup2
C75 C76 C78 C79 = 10U-6032-20V: CAP;10U  ,TT,20V ,20%,6032,SMT
J7 = Header 2: Header, 2-Pin; LatestRevisionDate: 17-Jul-2002; LatestRevisionNote: Re-released for DXP Platform.; Publisher: Altium Limited
L8 L11 = INDUCTOR_4
R7 R8 R90-R104 R106 R108 R109 = P_R
U13 = TLV320AIC1106PWG4: PCM CODEC With Microphone Amps & Speaker Driver, 20-Pin TSSOP; Published: 16-Dec-2005; DatasheetVersion: 13-Sep-2005; PackageVersion: Feb-1999; PackageReference: PW020; Publisher: Altium Limited; PackageDescription: Shrink Small Outline; 20 Leads; Body Width 4.4 mm; Pitch 0.65 mm; ComponentLink1Description: Manufacturer Link; ComponentLink1URL: http://www.ti.com/; ComponentLink2Description: Datasheet; ComponentLink2URL: http://focus.ti.com/lit/ds/symlink/tlv320aic1106.pdf
U21 = 74LVC1G04GW_SOT353-5: Part  Number: SA00000FX00

## Sheet [08]GPS.SchDoc
size A4
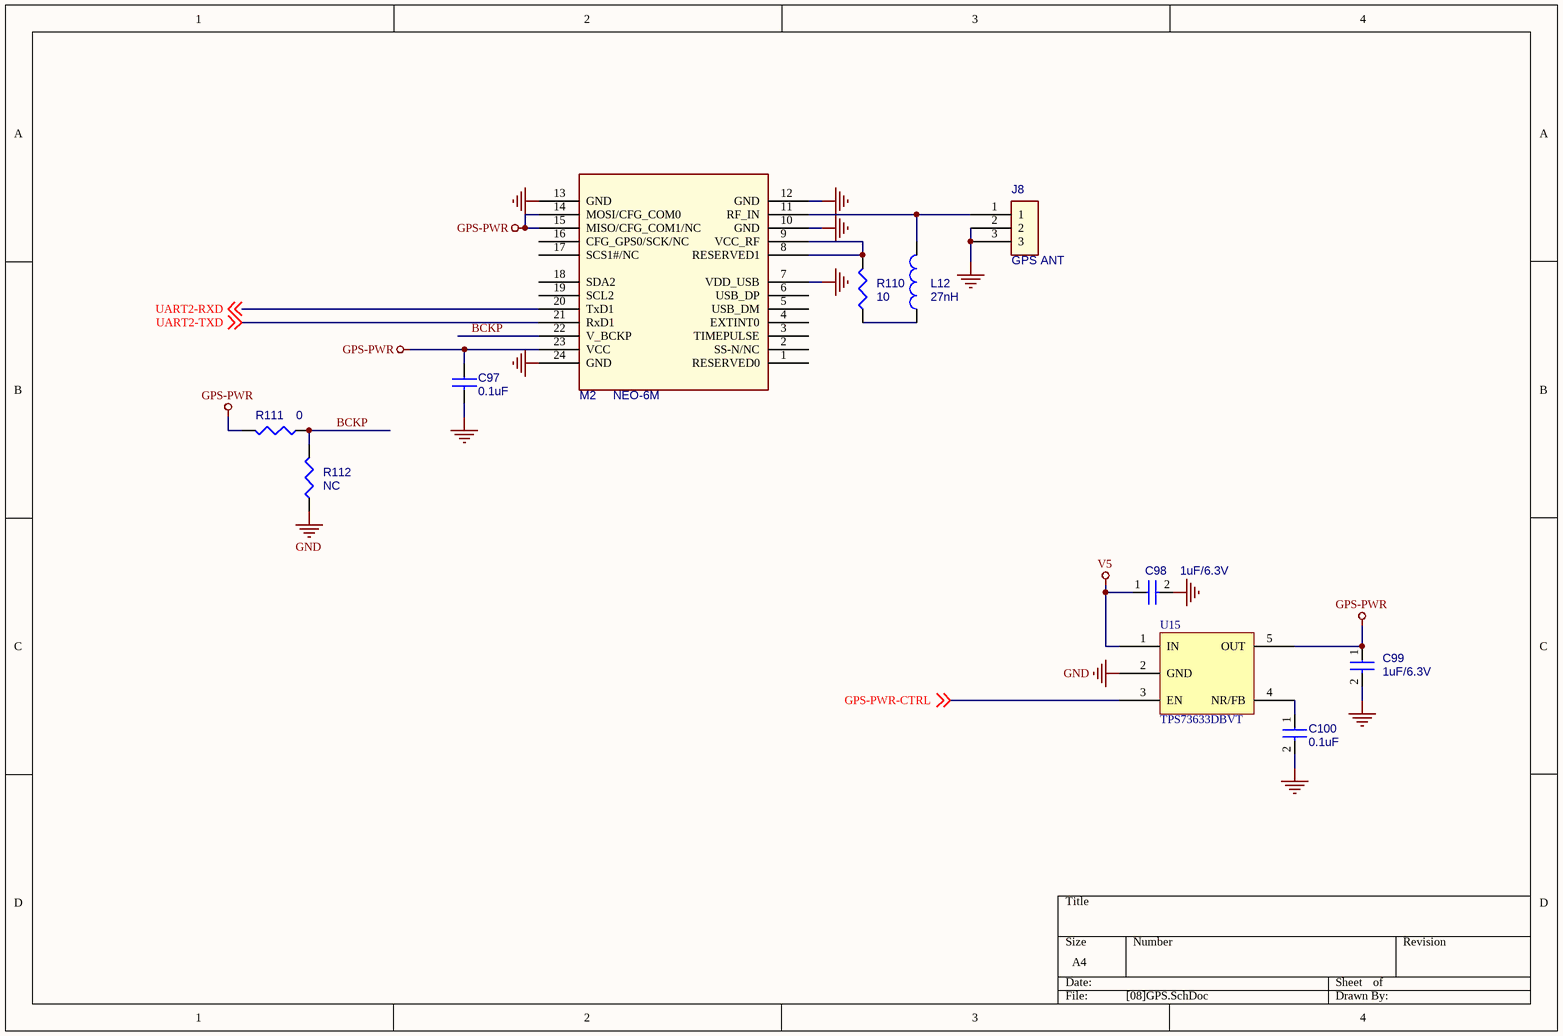
[diagram p7: [08]GPS.SchDoc]

### Parts
C97  0.1uF  [0603]
C98  1uF/6.3V  [0603]
C99  1uF/6.3V  [0603]
C100  0.1uF  [0603]
J8  GPS ANT  [ANT]
L12  27nH  [0603]
M2  NEO-6M  [NEO-6]
R110  10  [0603]
R111  0  [0603]
R112  NC  [0603]
U15  TPS73633DBVT  [SOT23-5]

### Nets
GND: C97.2 C98.2 C99.2 C100.2 J8.2 J8.3 M2.7(VDD_USB) M2.10(GND) M2.12(GND) M2.13(GND) M2.24(GND) R112.1 U15.2(GND)
GPS-PWR: C97.1 C99.1 M2.14(MOSI/CFG_COM0) M2.15(MISO/CFG_COM1/NC) M2.23(VCC) R111.2 U15.5(OUT)
V5: C98.1 U15.1(IN)
BCKP: M2.22(V_BCKP) R111.1 R112.2
GPS-PWR-CTRL: U15.3(EN) ; off-sheet GPS-PWR-CTRL
UART2-RXD: M2.20(TxD1) ; off-sheet UART2-RXD
UART2-TXD: M2.21(RxD1) ; off-sheet UART2-TXD
NetC100_1: C100.1 U15.4(NR/FB)
NetJ8_1: J8.1 L12.2 M2.11(RF_IN)
NetL12_1: L12.1 R110.1
NetM2_8: M2.8(RESERVED1) M2.9(VCC_RF) R110.2

Not connected (* = marked no-connect by the designer): M2 1(RESERVED0) 2(SS-N/NC) 3(TIMEPULSE) 4(EXTINT0) 5(USB_DM) 6(USB_DP) 16(CFG_GPS0/SCK/NC) 17(SCS1#/NC) 18(SDA2) 19(SCL2)

### Library data of the parts
C97 = P_CAP NP
C98-C100 = CAP NP_Dup2
J8 = HRS_U_0.FL-R-SMT-10
L12 = 2.2UH_LPS3015-222MLC_1.5A_20%~D
M2 = NEO-5M
R110-R112 = P_R

## Sheet [09]ADC.SchDoc
size B

## Sheet [10]MISC.SchDoc
size A4
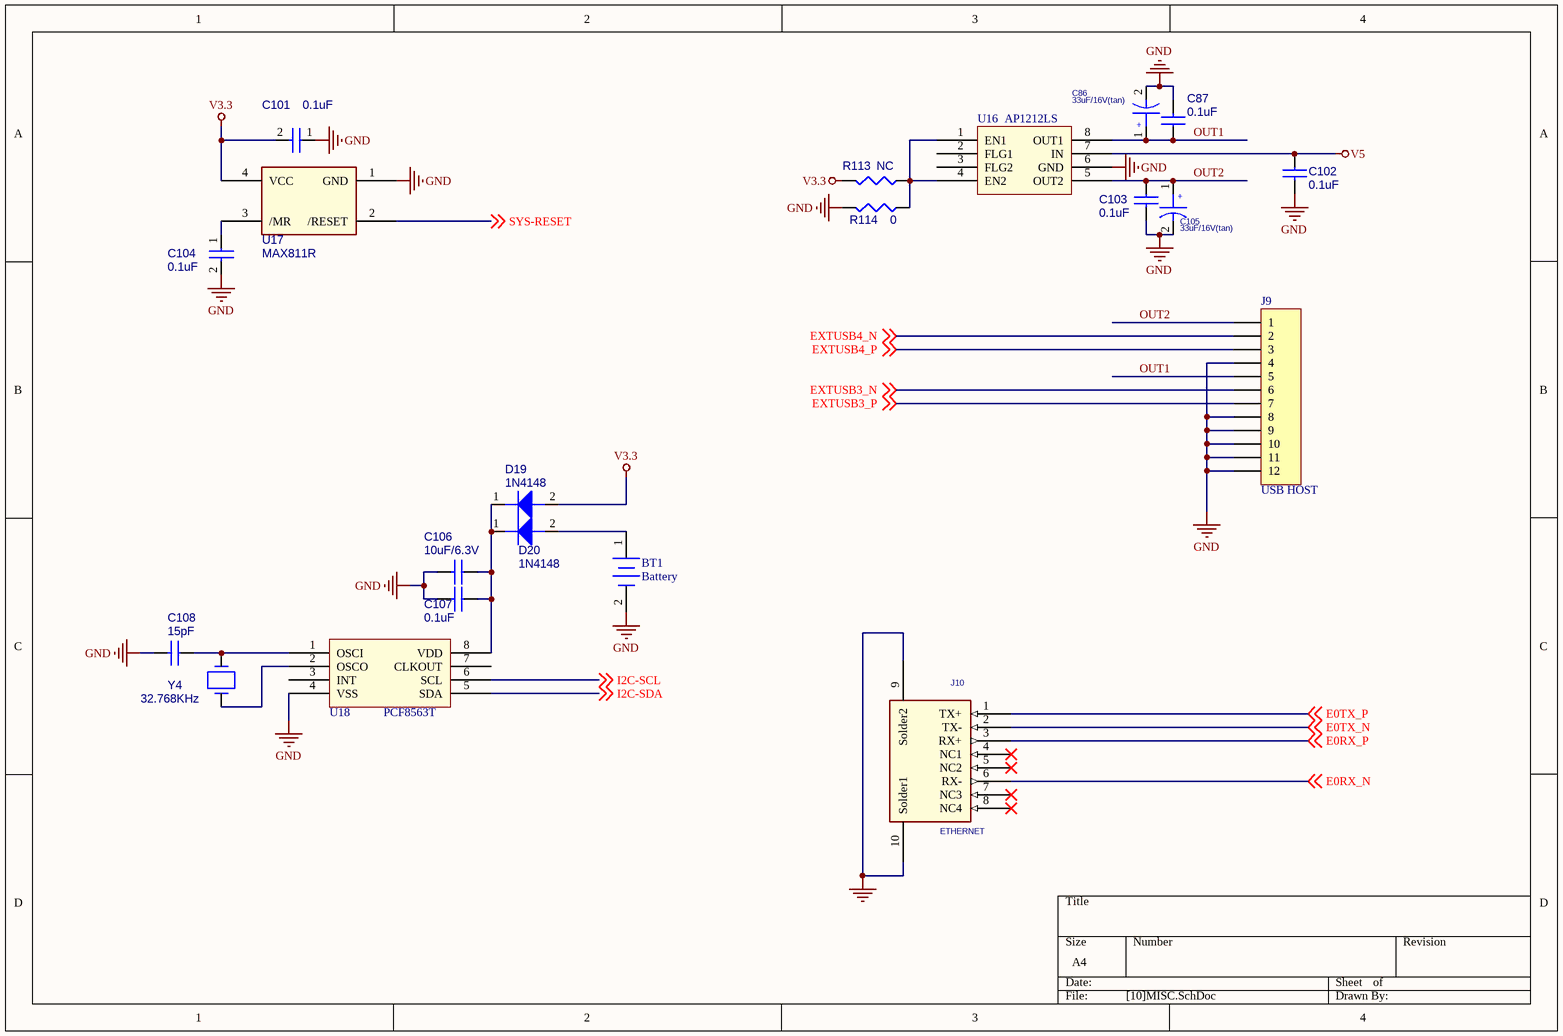
[diagram p8: [10]MISC.SchDoc]

### Parts
BT1  Battery  [CR1220]
C86  33uF/16V(tan)  [3528]
C87  0.1uF  [0603]
C101  0.1uF  [0603]
C102  0.1uF  [0603]
C103  0.1uF  [0603]
C104  0.1uF  [0603]
C105  33uF/16V(tan)  [3528]
C106  10uF/6.3V  [0805]
C107  0.1uF  [0603]
C108  15pF  [0603]
D19  1N4148  [MINI-MELF]
D20  1N4148  [MINI-MELF]
J9  USB HOST  [USB-HOST-2]
J10  ETHERNET  [RJ45]
R113  NC  [0603]
R114  0  [0603]
U16  AP1212LS  [SO8]
U17  MAX811R  [SOT143]
U18  PCF8563T  [SO8]
Y4  32.768KHz  [XTAL]

### Nets
GND: BT1.2(-) C86.2 C87.2 C101.1 C102.2 C103.2 C104.2 C105.2 C106.2 C107.2 C108.2 J9.4 J9.8 J9.9 J9.10 J9.11 J9.12 J10.9(Solder2) J10.10(Solder1) R114.2 U16.6(GND) U17.1(GND) U18.4(VSS)
V3.3: C101.2 D19.2 R113.2 U17.4(VCC)
V5: C102.1 U16.7(IN)
E0RX_N: J10.6(RX-) ; off-sheet E0RX_N
E0RX_P: J10.3(RX+) ; off-sheet E0RX_P
E0TX_N: J10.2(TX-) ; off-sheet E0TX_N
E0TX_P: J10.1(TX+) ; off-sheet E0TX_P
EXTUSB3_N: J9.6 ; off-sheet EXTUSB3_N
EXTUSB3_P: J9.7 ; off-sheet EXTUSB3_P
EXTUSB4_N: J9.2 ; off-sheet EXTUSB4_N
EXTUSB4_P: J9.3 ; off-sheet EXTUSB4_P
I2C-SCL: U18.6(SCL) ; off-sheet I2C-SCL
I2C-SDA: U18.5(SDA) ; off-sheet I2C-SDA
OUT1: C86.1 C87.1 J9.5 U16.8(OUT1)
OUT2: C103.1 C105.1 J9.1 U16.5(OUT2)
SYS-RESET: U17.2(/RESET) ; off-sheet SYS-RESET
NetBT1_1: BT1.1(+) D20.2
NetC104_1: C104.1 U17.3(/MR)
NetC106_1: C106.1 C107.1 D19.1 D20.1 U18.8(VDD)
NetC108_1: C108.1 U18.1(OSCI) Y4.2
NetR113_1: R113.1 R114.1 U16.1(EN1) U16.4(EN2)
NetU18_2: U18.2(OSCO) Y4.1

Not connected (* = marked no-connect by the designer): J10 4(NC1)* 5(NC2)* 7(NC3)* 8(NC4)*; U16 2(FLG1) 3(FLG2); U18 3(INT) 7(CLKOUT)

### Notes on the sheet
- (in symbol CAP WP) +

### Library data of the parts
BT1 = Battery: Multicell Battery
C86 C105 = CAP WP
C87 C102 C103 C106-C108 = CAP_Dup1
C101 C104 = CAP NP_Dup2
D19 D20 = 1N4148WS-7-F_SOD323-2
J9 = Header 12: Header, 12-Pin; LatestRevisionDate: 17-Jul-2002; LatestRevisionNote: Re-released for DXP Platform.; Publisher: Altium Limited
J10 = NET
R113 = R: Part Number: SD02810028L; Part Description: S RES 1/16W 10K +-5% 0402; Manufacturer Part number: null; Ecology: YES; Function Field: 32.3; Deletion Flag: 0; ROOM: SD; Lead Free: Y1; AP: AP; AP Sheet: http://ISPDPRD/Windchill/servlet/WindchillAuthGW/wt.enterprise.URLProcessor/URLTemplateAction?u8&oid=VR%3Aext.compal.part.Comp; Part Type: RESISTOR
R114 = R: Part Number: SD02810028L; Part Description: S RES 1/16W 10K +-5% 0402; Manufacturer Part number: null; Ecology: YES; Function Field: 32.3; ROOM: SD; Lead Free: Y1; AP: AP; AP Sheet: http://ISPDPRD/Windchill/servlet/WindchillAuthGW/wt.enterprise.URLProcessor/URLTemplateAction?u8&oid=VR%3Aext.compal.part.Comp; Part Type: RESISTOR; Deletion Flag: 0
U16 = AP1212
U17 = MAX811
Y4 = CRYSTAL

## Sheet [11]SERIAL_PORT.SchDoc
size B
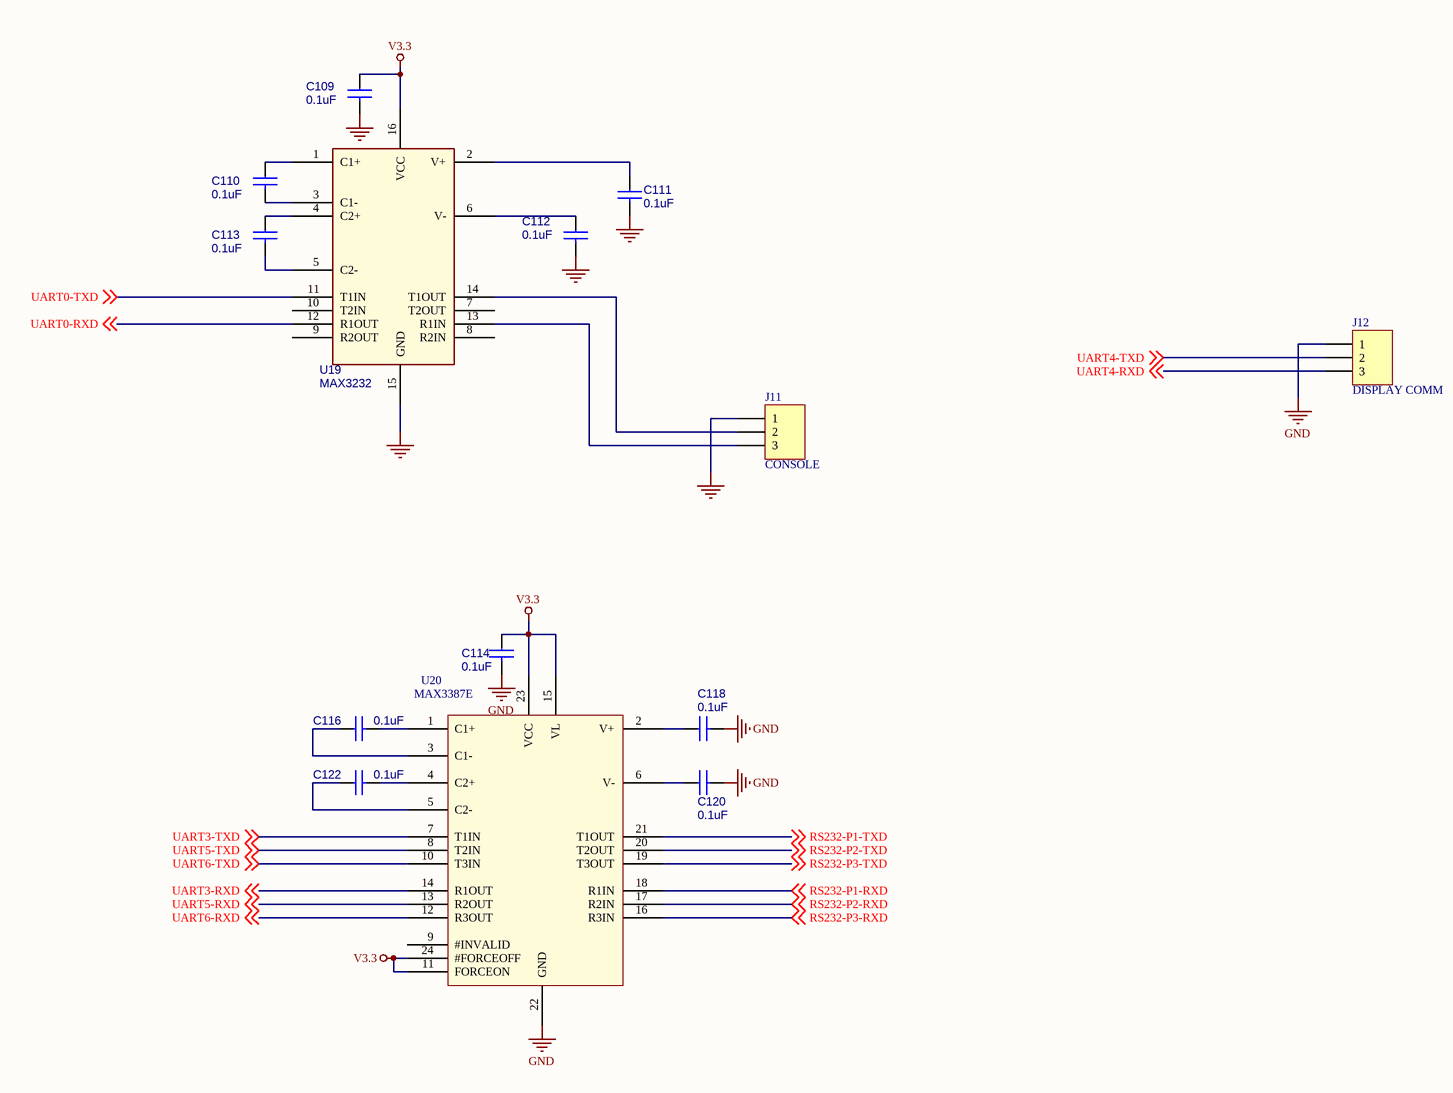
[diagram p9: [11]SERIAL_PORT.SchDoc]

### Parts
C109  0.1uF  [0603]
C110  0.1uF  [0603]
C111  0.1uF  [0603]
C112  0.1uF  [0603]
C113  0.1uF  [0603]
C114  0.1uF  [0603]
C116  0.1uF  [0603]
C118  0.1uF  [0603]
C120  0.1uF  [0603]
C122  0.1uF  [0603]
J11  CONSOLE  [CONN-3P]
J12  DISPLAY COMM  [CONN-3P]
U19  MAX3232  [SO-16]
U20  MAX3387E  [SSOP24]

### Nets
GND: C109.2 C111.2 C112.2 C114.2 C118.2 C120.2 J11.1 J12.1 U19.15(GND) U20.22(GND)
V3.3: C109.1 C114.1 U19.16(VCC) U20.11(FORCEON) U20.15(VL) U20.23(VCC) U20.24(#FORCEOFF)
RS232-P1-RXD: U20.18(R1IN) ; off-sheet RS232-P1-RXD
RS232-P1-TXD: U20.21(T1OUT) ; off-sheet RS232-P1-TXD
RS232-P2-RXD: U20.17(R2IN) ; off-sheet RS232-P2-RXD
RS232-P2-TXD: U20.20(T2OUT) ; off-sheet RS232-P2-TXD
RS232-P3-RXD: U20.16(R3IN) ; off-sheet RS232-P3-RXD
RS232-P3-TXD: U20.19(T3OUT) ; off-sheet RS232-P3-TXD
UART0-RXD: U19.12(R1OUT) ; off-sheet UART0-RXD
UART0-TXD: U19.11(T1IN) ; off-sheet UART0-TXD
UART3-RXD: U20.14(R1OUT) ; off-sheet UART3-RXD
UART3-TXD: U20.7(T1IN) ; off-sheet UART3-TXD
UART4-RXD: J12.3 ; off-sheet UART4-RXD
UART4-TXD: J12.2 ; off-sheet UART4-TXD
UART5-RXD: U20.13(R2OUT) ; off-sheet UART5-RXD
UART5-TXD: U20.8(T2IN) ; off-sheet UART5-TXD
UART6-RXD: U20.12(R3OUT) ; off-sheet UART6-RXD
UART6-TXD: U20.10(T3IN) ; off-sheet UART6-TXD
NetC110_1: C110.1 U19.1(C1+)
NetC110_2: C110.2 U19.3(C1-)
NetC111_1: C111.1 U19.2(V+)
NetC112_1: C112.1 U19.6(V-)
NetC113_1: C113.1 U19.4(C2+)
NetC113_2: C113.2 U19.5(C2-)
NetC116_1: C116.1 U20.3(C1-)
NetC116_2: C116.2 U20.1(C1+)
NetC118_1: C118.1 U20.2(V+)
NetC120_1: C120.1 U20.6(V-)
NetC122_1: C122.1 U20.5(C2-)
NetC122_2: C122.2 U20.4(C2+)
NetJ11_2: J11.2 U19.14(T1OUT)
NetJ11_3: J11.3 U19.13(R1IN)

Not connected (* = marked no-connect by the designer): U19 7(T2OUT) 8(R2IN) 9(R2OUT) 10(T2IN); U20 9(#INVALID)

### Library data of the parts
C109-C114 C116 C118 C120 C122 = CAP
J11 J12 = Header 3: Header, 3-Pin; LatestRevisionDate: 17-Jul-2002; LatestRevisionNote: Re-released for DXP Platform.; Publisher: Altium Limited

## Sheet [12]IO_PORT.SchDoc
size A4
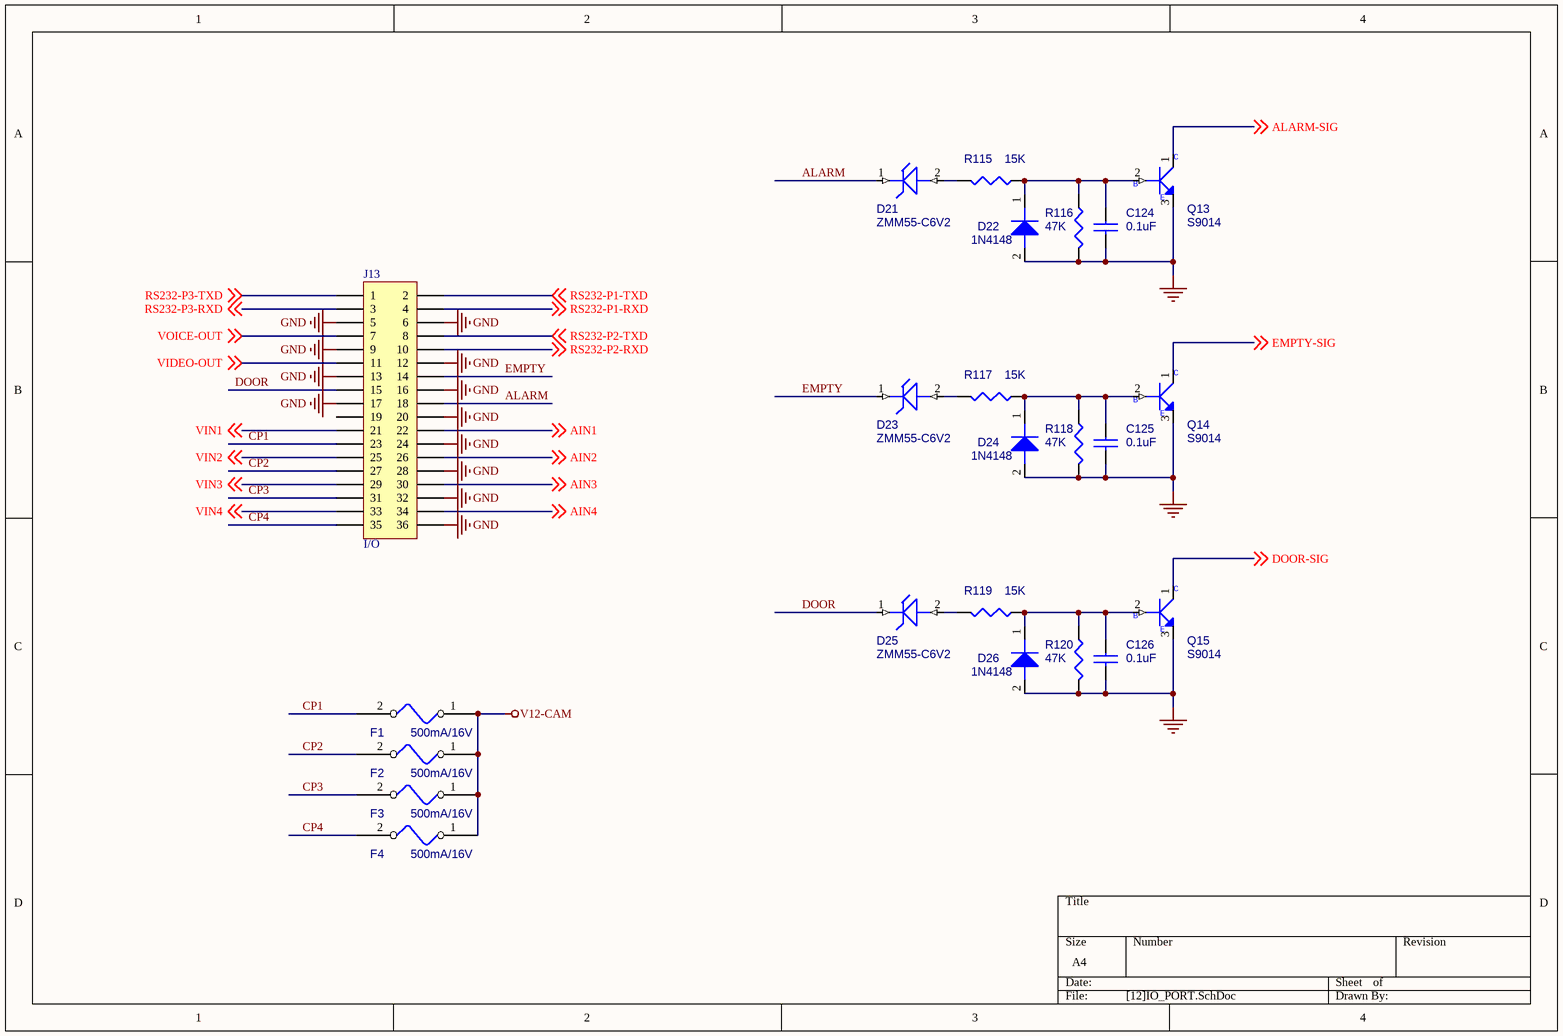
[diagram p10: [12]IO_PORT.SchDoc]

### Parts
C124  0.1uF  [0603]
C125  0.1uF  [0603]
C126  0.1uF  [0603]
D21  ZMM55-C6V2  [MINI-MELF]
D22  1N4148  [MINI-MELF]
D23  ZMM55-C6V2  [MINI-MELF]
D24  1N4148  [MINI-MELF]
D25  ZMM55-C6V2  [MINI-MELF]
D26  1N4148  [MINI-MELF]
F1  500mA/16V  [1812]
F2  500mA/16V  [1812]
F3  500mA/16V  [1812]
F4  500mA/16V  [1812]
J13  I/O  [AMP174146]
Q13  S9014  [NPN]
Q14  S9014  [NPN]
Q15  S9014  [NPN]
R115  15K  [0603]
R116  47K  [0603]
R117  15K  [0603]
R118  47K  [0603]
R119  15K  [0603]
R120  47K  [0603]

### Nets
GND: C124.2 C125.2 C126.2 D22.2 D24.2 D26.2 J13.5 J13.6 J13.9 J13.12 J13.13 J13.16 J13.17 J13.20 J13.24 J13.28 J13.32 J13.36 Q13.3(EMITTER) Q14.3(EMITTER) Q15.3(EMITTER) R116.2 R118.2 R120.2
V12-CAM: F1.1 F2.1 F3.1 F4.1
AIN1: J13.22 ; off-sheet AIN1
AIN2: J13.26 ; off-sheet AIN2
AIN3: J13.30 ; off-sheet AIN3
AIN4: J13.34 ; off-sheet AIN4
ALARM: D21.1 J13.18
ALARM-SIG: Q13.1(COLLECTOR) ; off-sheet ALARM-SIG
CP1: F1.2 J13.23
CP2: F2.2 J13.27
CP3: F3.2 J13.31
CP4: F4.2 J13.35
DOOR: D25.1 J13.15
DOOR-SIG: Q15.1(COLLECTOR) ; off-sheet DOOR-SIG
EMPTY: D23.1 J13.14
EMPTY-SIG: Q14.1(COLLECTOR) ; off-sheet EMPTY-SIG
RS232-P1-RXD: J13.4 ; off-sheet RS232-P1-RXD
RS232-P1-TXD: J13.2 ; off-sheet RS232-P1-TXD
RS232-P2-RXD: J13.10 ; off-sheet RS232-P2-RXD
RS232-P2-TXD: J13.8 ; off-sheet RS232-P2-TXD
RS232-P3-RXD: J13.3 ; off-sheet RS232-P3-RXD
RS232-P3-TXD: J13.1 ; off-sheet RS232-P3-TXD
VIDEO-OUT: J13.11 ; off-sheet VIDEO-OUT
VIN1: J13.21 ; off-sheet VIN1
VIN2: J13.25 ; off-sheet VIN2
VIN3: J13.29 ; off-sheet VIN3
VIN4: J13.33 ; off-sheet VIN4
VOICE-OUT: J13.7 ; off-sheet VOICE-OUT
NetC124_1: C124.1 D22.1 Q13.2(BASE) R115.1 R116.1
NetC125_1: C125.1 D24.1 Q14.2(BASE) R117.1 R118.1
NetC126_1: C126.1 D26.1 Q15.2(BASE) R119.1 R120.1
NetD21_2: D21.2 R115.2
NetD23_2: D23.2 R117.2
NetD25_2: D25.2 R119.2

Not connected (* = marked no-connect by the designer): J13 19

### Notes on the sheet
- (in symbol MMBT3904_NL_SOT23-3) C; B; E

### Library data of the parts
C124-C126 = CAP
D21 D23 D25 = MMGZ5231BPTLL34
D22 D24 D26 = 1N4148WS-7-F_SOD323-2
F1-F4 = 2A_32VDC_0467-002
J13 = Header 18X2H: Header, 18-Pin, Dual row, Right Angle; LatestRevisionDate: 17-Jul-2002; LatestRevisionNote: Re-released for DXP Platform.; Publisher: Altium Limited
Q13-Q15 = MMBT3904_NL_SOT23-3: as Q3 on sheet [01]POWER
R115-R120 = R

## Nets that join several sheets
GND: [01]POWER (56 pins), [02]MCU (9 pins), [03]CORE_BOARD (39 pins), [04]STORAGE (18 pins), [05]USB_HUB (27 pins), [06]EXT_UART (18 pins), [07]CELLULAR (37 pins), [08]GPS (13 pins), [10]MISC (23 pins), [11]SERIAL_PORT (10 pins), [12]IO_PORT (24 pins)
V3.3: [01]POWER (C19.1 L1.2 R20.1), [04]STORAGE (20 pins), [05]USB_HUB (11 pins), [06]EXT_UART (32 pins), [07]CELLULAR (C35.1 R7.1 U14.4 U21.5), [10]MISC (C101.2 D19.2 R113.2 U17.4), [11]SERIAL_PORT (7 pins)
V3.3-MCU: [01]POWER (C4.2 U1.2 U1.4), [02]MCU (21 pins)
V3.3-SD: [03]CORE_BOARD (M1.B4), [04]STORAGE (C51.2 J4.4)
V5: [01]POWER (C29.1 L3.2 R38.1), [03]CORE_BOARD (9 pins), [08]GPS (C98.1 U15.1), [10]MISC (C102.1 U16.7)
V12-CAM: [01]POWER (5 pins), [12]IO_PORT (F1.1 F2.1 F3.1 F4.1)
AIN1: [03]CORE_BOARD (M1.C31), [12]IO_PORT (J13.22)
AIN2: [03]CORE_BOARD (M1.C27), [12]IO_PORT (J13.26)
AIN3: [03]CORE_BOARD (M1.C23), [12]IO_PORT (J13.30)
AIN4: [03]CORE_BOARD (M1.C19), [12]IO_PORT (J13.34)
ALARM-SIG: [02]MCU (R54.2 U5.40), [12]IO_PORT (Q13.1)
C-PWR-CTRL: [02]MCU (U5.37), [07]CELLULAR (U21.2)
CAM-PWR: [01]POWER (R10.1), [02]MCU (R48.2 U5.31)
CELLULAR-RESET: [02]MCU (U5.34), [07]CELLULAR (J5.22)
DOOR-SIG: [02]MCU (R56.2 U5.1), [12]IO_PORT (Q15.1)
E0RX_N: [03]CORE_BOARD (M1.A59), [10]MISC (J10.6)
E0RX_P: [03]CORE_BOARD (M1.A60), [10]MISC (J10.3)
E0TX_N: [03]CORE_BOARD (M1.A57), [10]MISC (J10.2)
E0TX_P: [03]CORE_BOARD (M1.A58), [10]MISC (J10.1)
EBIA0: [03]CORE_BOARD (M1.B43), [06]EXT_UART (U11.24)
EBIA1: [03]CORE_BOARD (M1.B46), [06]EXT_UART (U11.23)
EBIA2: [03]CORE_BOARD (M1.B45), [06]EXT_UART (U11.22)
EBIA3: [03]CORE_BOARD (M1.B48), [06]EXT_UART (U10.2)
EBIA4: [03]CORE_BOARD (M1.B47), [06]EXT_UART (U10.3)
EBICS1: [03]CORE_BOARD (M1.B21), [06]EXT_UART (R83.1 U10.1)
EBID0: [03]CORE_BOARD (M1.B42), [06]EXT_UART (U11.53)
EBID1: [03]CORE_BOARD (M1.B40), [06]EXT_UART (U11.54)
EBID2: [03]CORE_BOARD (M1.B38), [06]EXT_UART (U11.55)
EBID3: [03]CORE_BOARD (M1.B36), [06]EXT_UART (U11.56)
EBID4: [03]CORE_BOARD (M1.B34), [06]EXT_UART (U11.57)
EBID5: [03]CORE_BOARD (M1.B32), [06]EXT_UART (U11.58)
EBID6: [03]CORE_BOARD (M1.B30), [06]EXT_UART (U11.59)
EBID7: [03]CORE_BOARD (M1.B28), [06]EXT_UART (U11.60)
EBIOE: [03]CORE_BOARD (M1.B19), [06]EXT_UART (U11.40)
EBIWE: [03]CORE_BOARD (M1.A12), [04]STORAGE (U7.18), [06]EXT_UART (U11.9)
EMPTY-SIG: [02]MCU (R55.2 U5.41), [12]IO_PORT (Q14.1)
EUARTA-INT: [03]CORE_BOARD (M1.A26), [06]EXT_UART (R84.1 U11.6)
EUARTB-INT: [03]CORE_BOARD (M1.A23), [06]EXT_UART (R85.1 U11.12)
EUARTC-INT: [03]CORE_BOARD (M1.A24), [06]EXT_UART (R86.1 U11.37)
EUARTD-INT: [03]CORE_BOARD (M1.A21), [06]EXT_UART (R87.1 U11.43)
EXTUSB1_N: [05]USB_HUB (U9.25), [07]CELLULAR (J5.36)
EXTUSB1_P: [05]USB_HUB (U9.26), [07]CELLULAR (J5.38)
EXTUSB3_N: [05]USB_HUB (U9.31), [10]MISC (J9.6)
EXTUSB3_P: [05]USB_HUB (U9.32), [10]MISC (J9.7)
EXTUSB4_N: [05]USB_HUB (U9.34), [10]MISC (J9.2)
EXTUSB4_P: [05]USB_HUB (U9.35), [10]MISC (J9.3)
FLASH-DB0: [03]CORE_BOARD (M1.B41), [04]STORAGE (U7.29)
FLASH-DB1: [03]CORE_BOARD (M1.B39), [04]STORAGE (U7.30)
FLASH-DB2: [03]CORE_BOARD (M1.B37), [04]STORAGE (U7.31)
FLASH-DB3: [03]CORE_BOARD (M1.B35), [04]STORAGE (U7.32)
FLASH-DB4: [03]CORE_BOARD (M1.B33), [04]STORAGE (U7.41)
FLASH-DB5: [03]CORE_BOARD (M1.B31), [04]STORAGE (U7.42)
FLASH-DB6: [03]CORE_BOARD (M1.B29), [04]STORAGE (U7.43)
FLASH-DB7: [03]CORE_BOARD (M1.B27), [04]STORAGE (U7.44)
GPS-PWR-CTRL: [02]MCU (R51.2 U5.36), [08]GPS (U15.3)
HAND-IN: [02]MCU (R46.2 U5.9), [03]CORE_BOARD (M1.A20)
HAND-OUT: [02]MCU (R45.2 U5.25), [03]CORE_BOARD (M1.B22)
I2C-SCL: [02]MCU (U5.13), [03]CORE_BOARD (M1.A37), [10]MISC (U18.6)
I2C-SDA: [02]MCU (U5.12), [03]CORE_BOARD (M1.A38), [10]MISC (U18.5)
IGN-SIG: [01]POWER (Q5.1), [02]MCU (R49.2 U5.24)
MAIN-PWR: [01]POWER (R12.1), [02]MCU (R47.2 U5.11)
NAND-ALE: [03]CORE_BOARD (M1.B26), [04]STORAGE (U7.17)
NAND-CE: [03]CORE_BOARD (M1.B24), [04]STORAGE (R59.1 U7.9)
NAND-CLE: [03]CORE_BOARD (M1.B20), [04]STORAGE (U7.16)
NAND-RDY: [03]CORE_BOARD (M1.B25), [04]STORAGE (R61.1 U7.7)
NAND-RE: [03]CORE_BOARD (M1.B17), [04]STORAGE (R60.1 U7.8)
REV-SIG: [01]POWER (Q6.1), [02]MCU (R50.2 U5.30)
RS232-P1-RXD: [11]SERIAL_PORT (U20.18), [12]IO_PORT (J13.4)
RS232-P1-TXD: [11]SERIAL_PORT (U20.21), [12]IO_PORT (J13.2)
RS232-P2-RXD: [11]SERIAL_PORT (U20.17), [12]IO_PORT (J13.10)
RS232-P2-TXD: [11]SERIAL_PORT (U20.20), [12]IO_PORT (J13.8)
RS232-P3-RXD: [11]SERIAL_PORT (U20.16), [12]IO_PORT (J13.3)
RS232-P3-TXD: [11]SERIAL_PORT (U20.19), [12]IO_PORT (J13.1)
SD-CARDIN: [03]CORE_BOARD (M1.B5), [04]STORAGE (Q11.1 R70.2 R71.2)
SD-CLK: [03]CORE_BOARD (M1.B11), [04]STORAGE (J4.5)
SD-CMD: [03]CORE_BOARD (M1.B12), [04]STORAGE (J4.3)
SD-DATA0: [03]CORE_BOARD (M1.B9), [04]STORAGE (J4.7)
SD-DATA1: [03]CORE_BOARD (M1.B10), [04]STORAGE (J4.8)
SD-DATA2: [03]CORE_BOARD (M1.B7), [04]STORAGE (J4.1)
SD-DATA3: [03]CORE_BOARD (M1.B8), [04]STORAGE (J4.2)
SD-WP: [03]CORE_BOARD (M1.B6), [04]STORAGE (R62.2 R66.2)
SYS-RESET: [05]USB_HUB (U8.2), [06]EXT_UART (U12.2), [10]MISC (U17.2)
UART0-RXD: [03]CORE_BOARD (M1.B16), [11]SERIAL_PORT (U19.12)
UART0-TXD: [03]CORE_BOARD (M1.B15), [11]SERIAL_PORT (U19.11)
UART2-RXD: [03]CORE_BOARD (M1.A35), [08]GPS (M2.20)
UART2-TXD: [03]CORE_BOARD (M1.A36), [08]GPS (M2.21)
UART3-RXD: [03]CORE_BOARD (M1.A33), [11]SERIAL_PORT (U20.14)
UART3-TXD: [03]CORE_BOARD (M1.A34), [11]SERIAL_PORT (U20.7)
UART4-RXD: [06]EXT_UART (U11.62), [11]SERIAL_PORT (J12.3)
UART4-TXD: [06]EXT_UART (U11.8), [11]SERIAL_PORT (J12.2)
UART5-RXD: [06]EXT_UART (U11.20), [11]SERIAL_PORT (U20.13)
UART5-TXD: [06]EXT_UART (U11.10), [11]SERIAL_PORT (U20.8)
UART6-RXD: [06]EXT_UART (U11.29), [11]SERIAL_PORT (U20.12)
UART6-TXD: [06]EXT_UART (U11.39), [11]SERIAL_PORT (U20.10)
USB0_N: [03]CORE_BOARD (M1.A15), [05]USB_HUB (U9.21)
USB0_P: [03]CORE_BOARD (M1.A16), [05]USB_HUB (U9.22)
USBHUB-RST: [02]MCU (U5.42), [05]USB_HUB (R78.1)
VIDEO-OUT: [03]CORE_BOARD (M1.C36), [12]IO_PORT (J13.11)
VIN1: [03]CORE_BOARD (M1.C32), [12]IO_PORT (J13.21)
VIN2: [03]CORE_BOARD (M1.C28), [12]IO_PORT (J13.25)
VIN3: [03]CORE_BOARD (M1.C24), [12]IO_PORT (J13.29)
VIN4: [03]CORE_BOARD (M1.C20), [12]IO_PORT (J13.33)
VOICE-OUT: [07]CELLULAR (C93.2), [12]IO_PORT (J13.7)